# EAGLE design Titan_v1p1_180 (EAGLE 9.6.2)
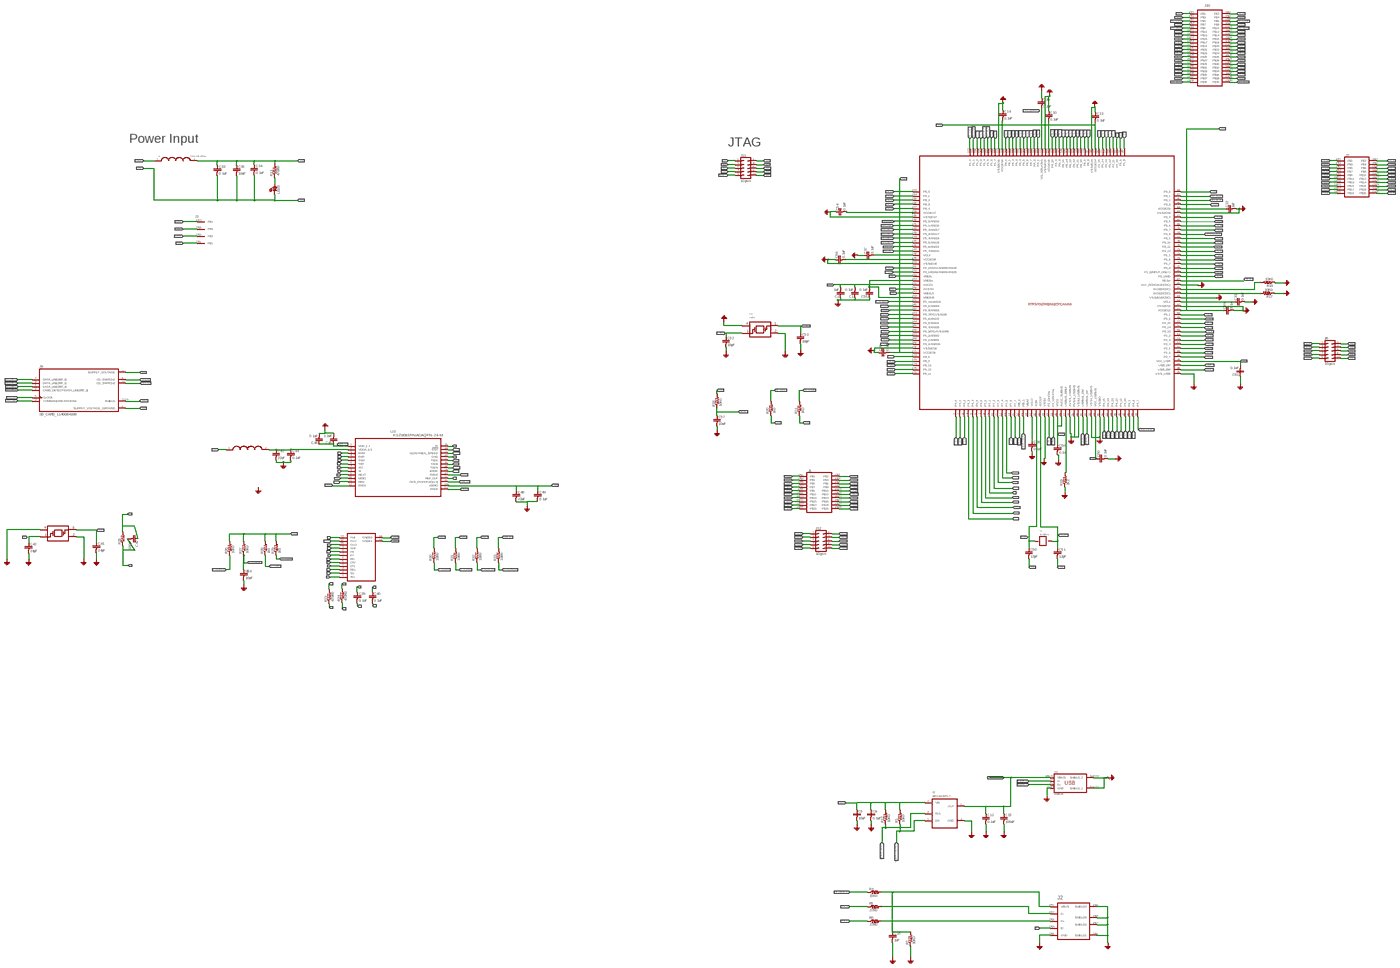
[diagram p0: schematic, sheet 1, overview]
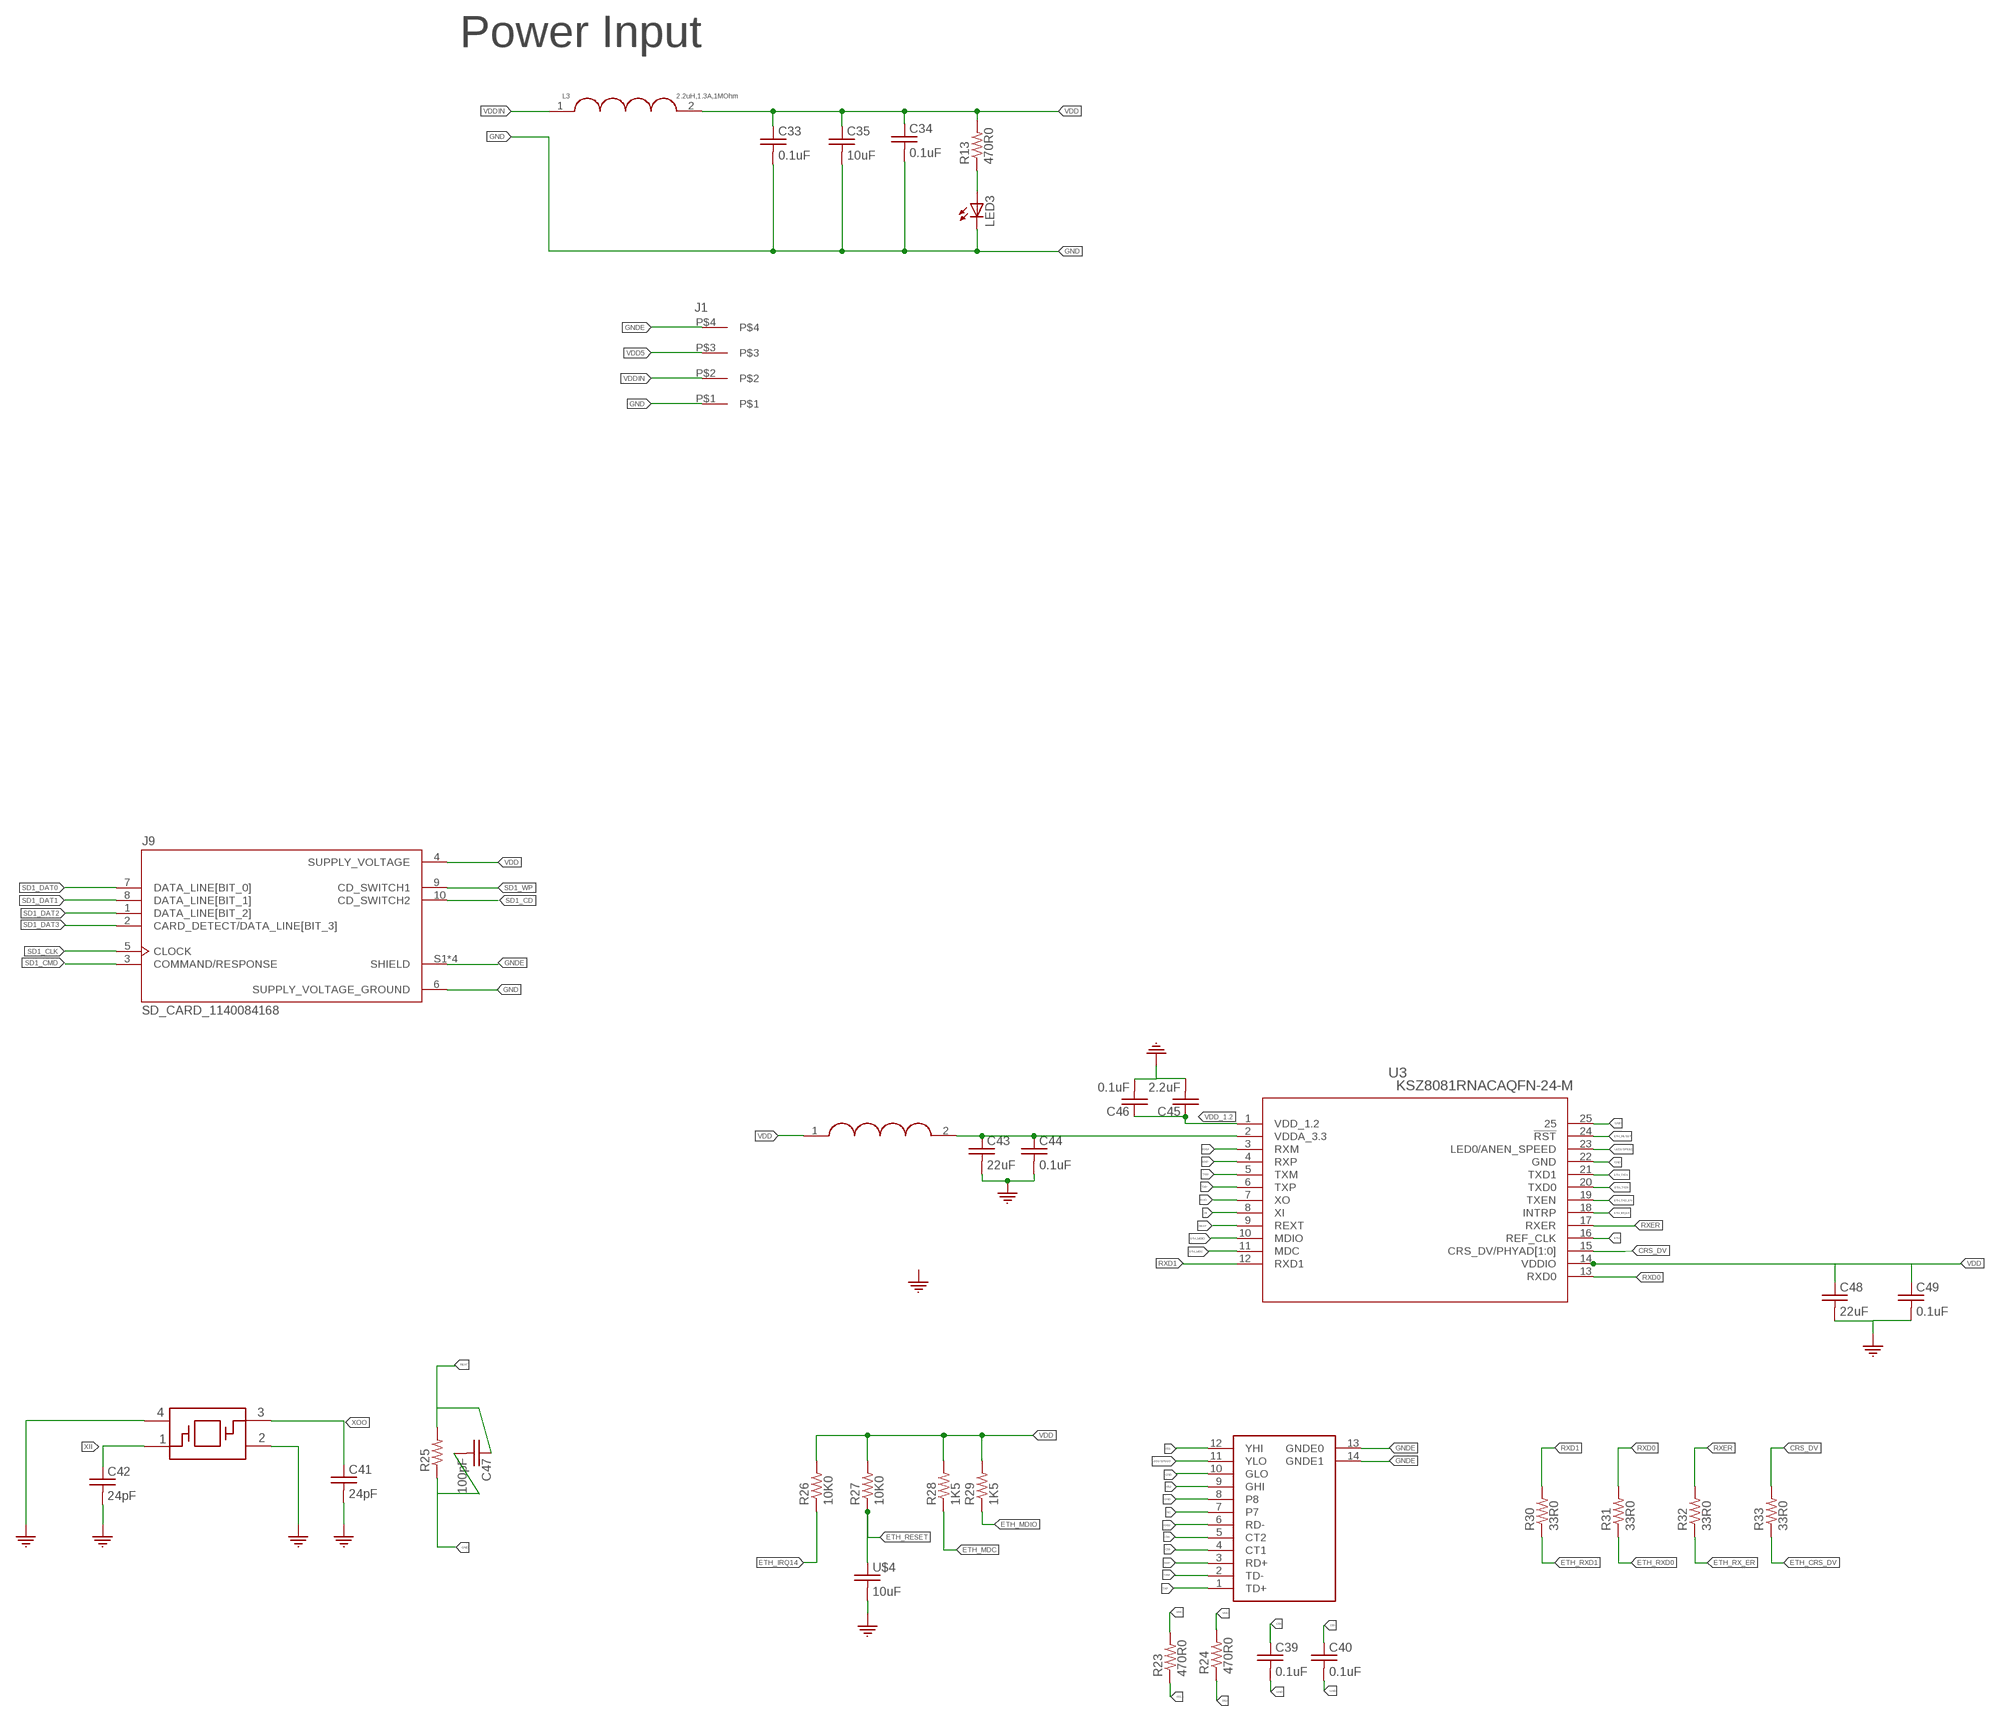
[diagram p1: schematic, sheet 1, part 1 of 4]
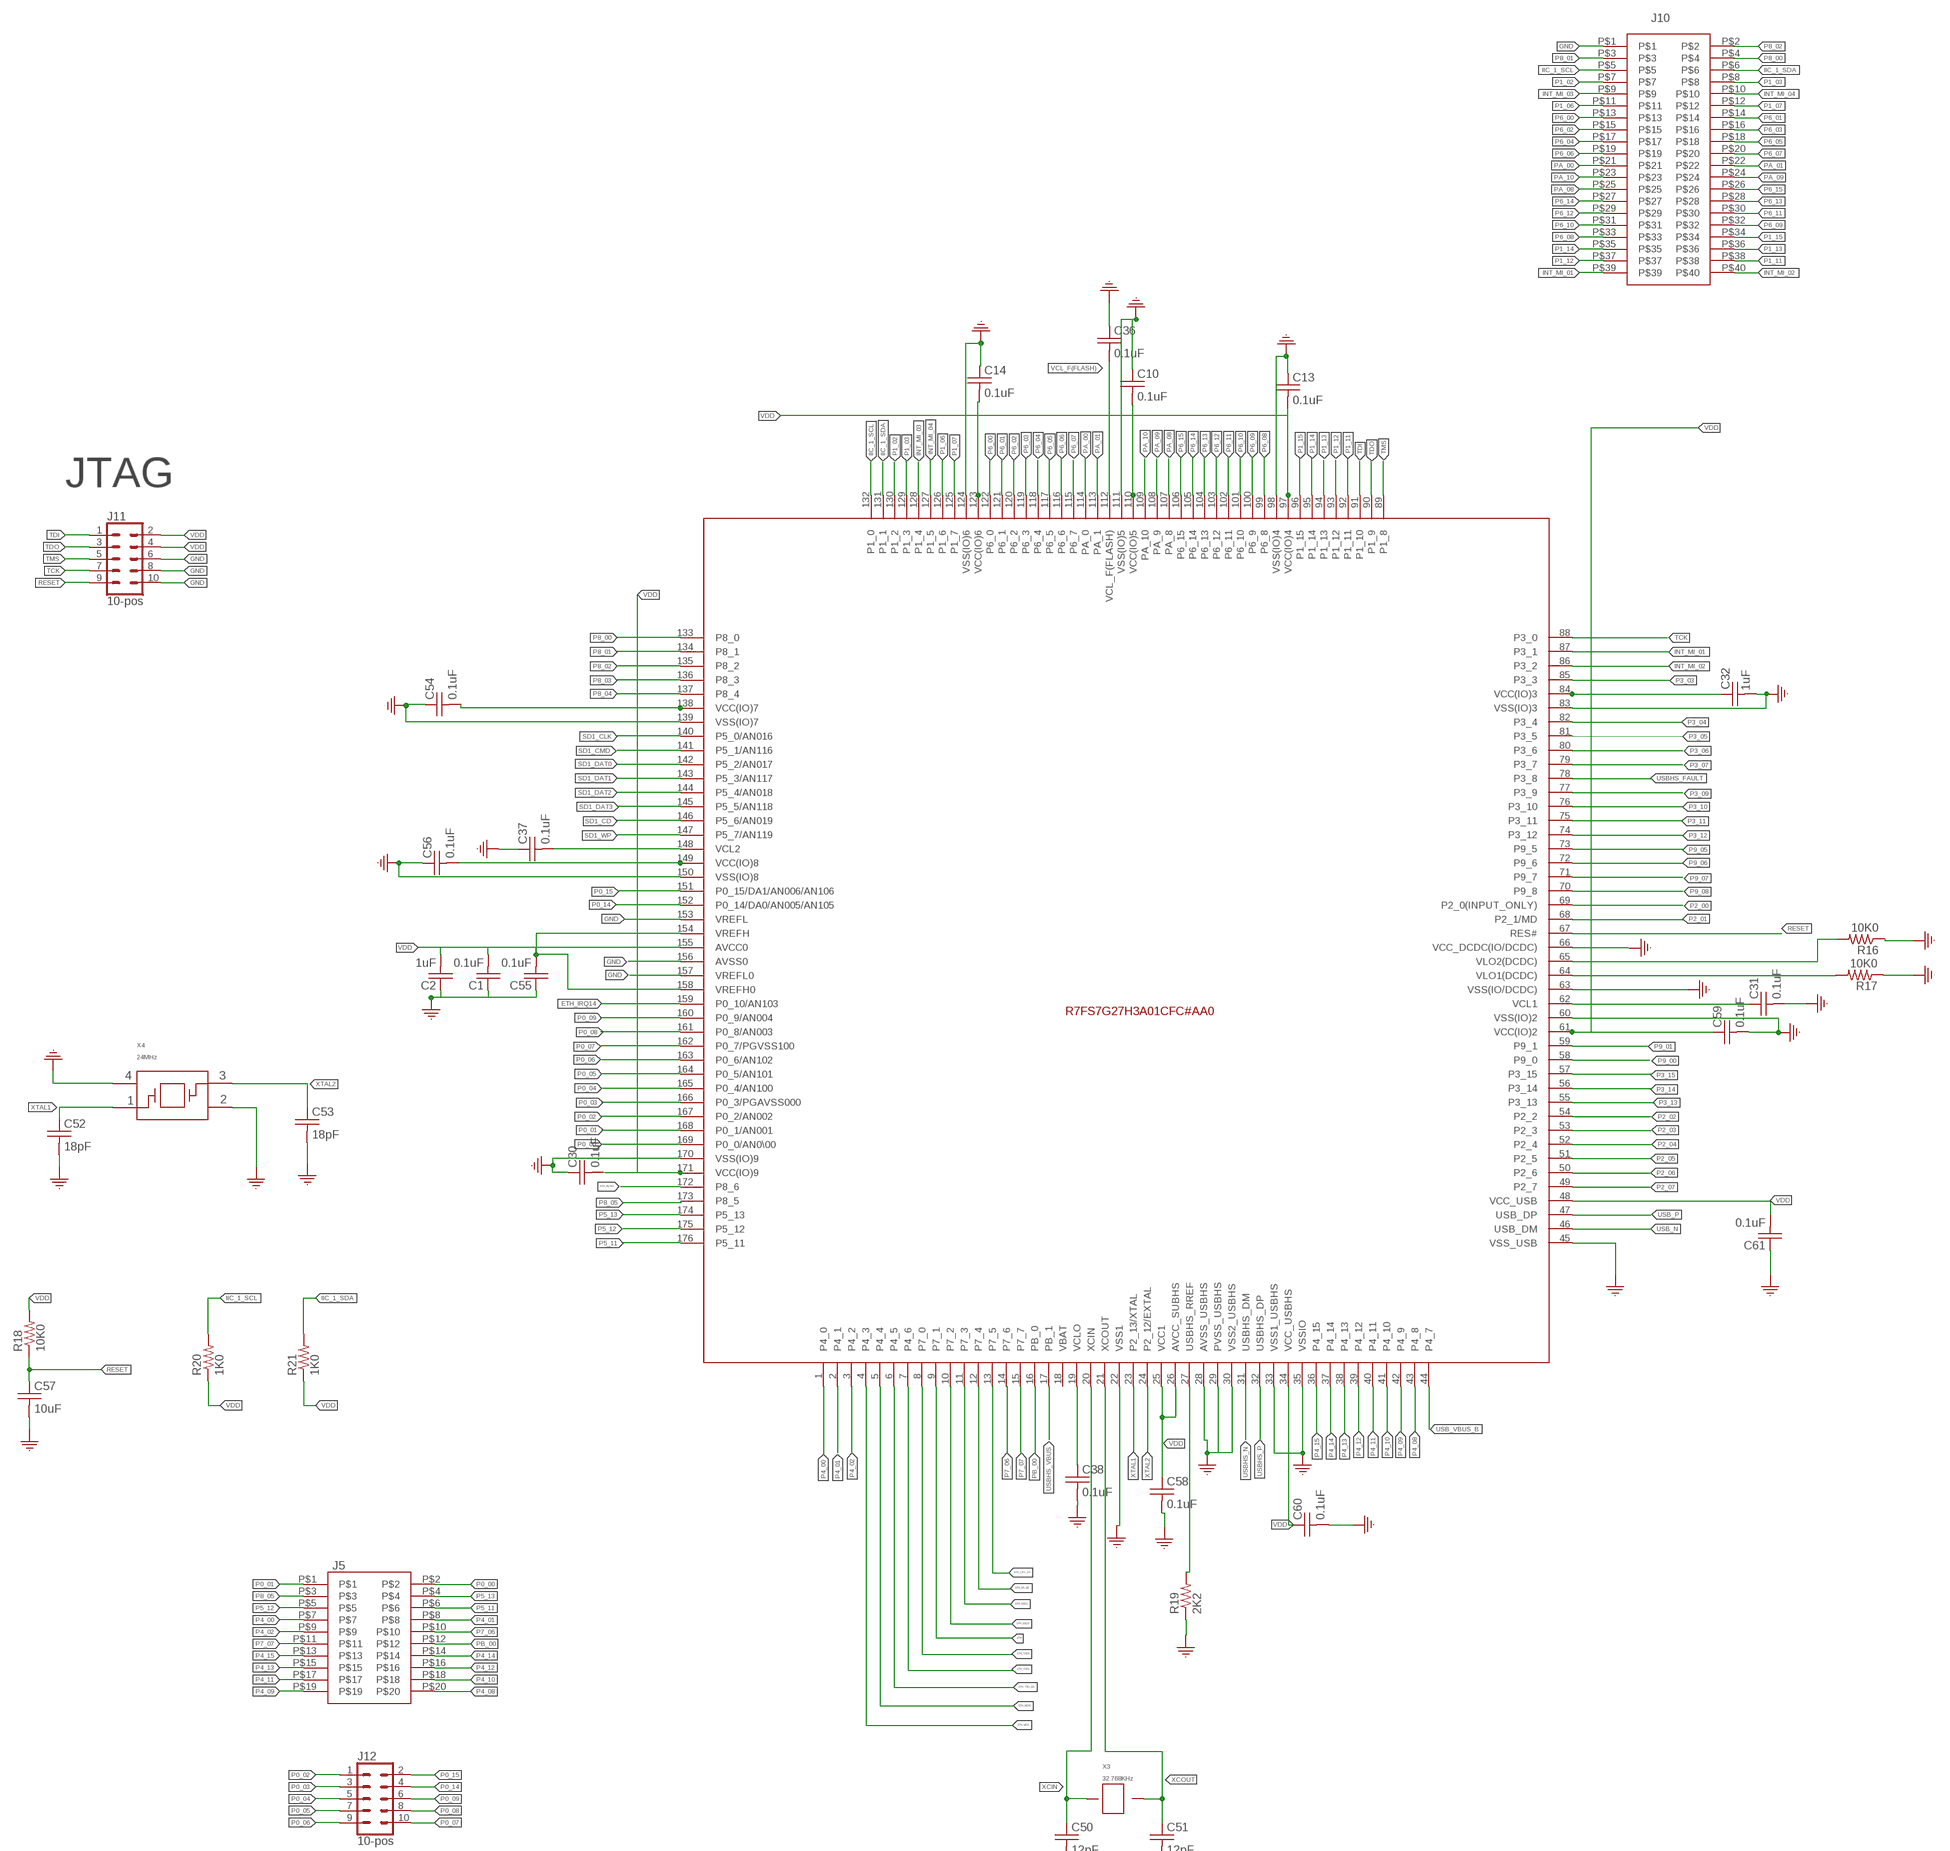
[diagram p2: schematic, sheet 1, part 2 of 4]
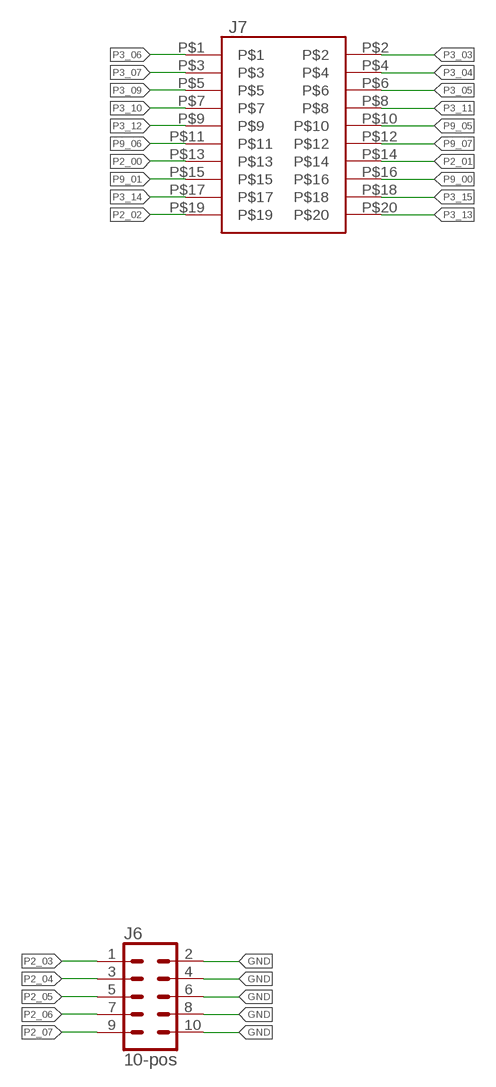
[diagram p3: schematic, sheet 1, part 3 of 4]
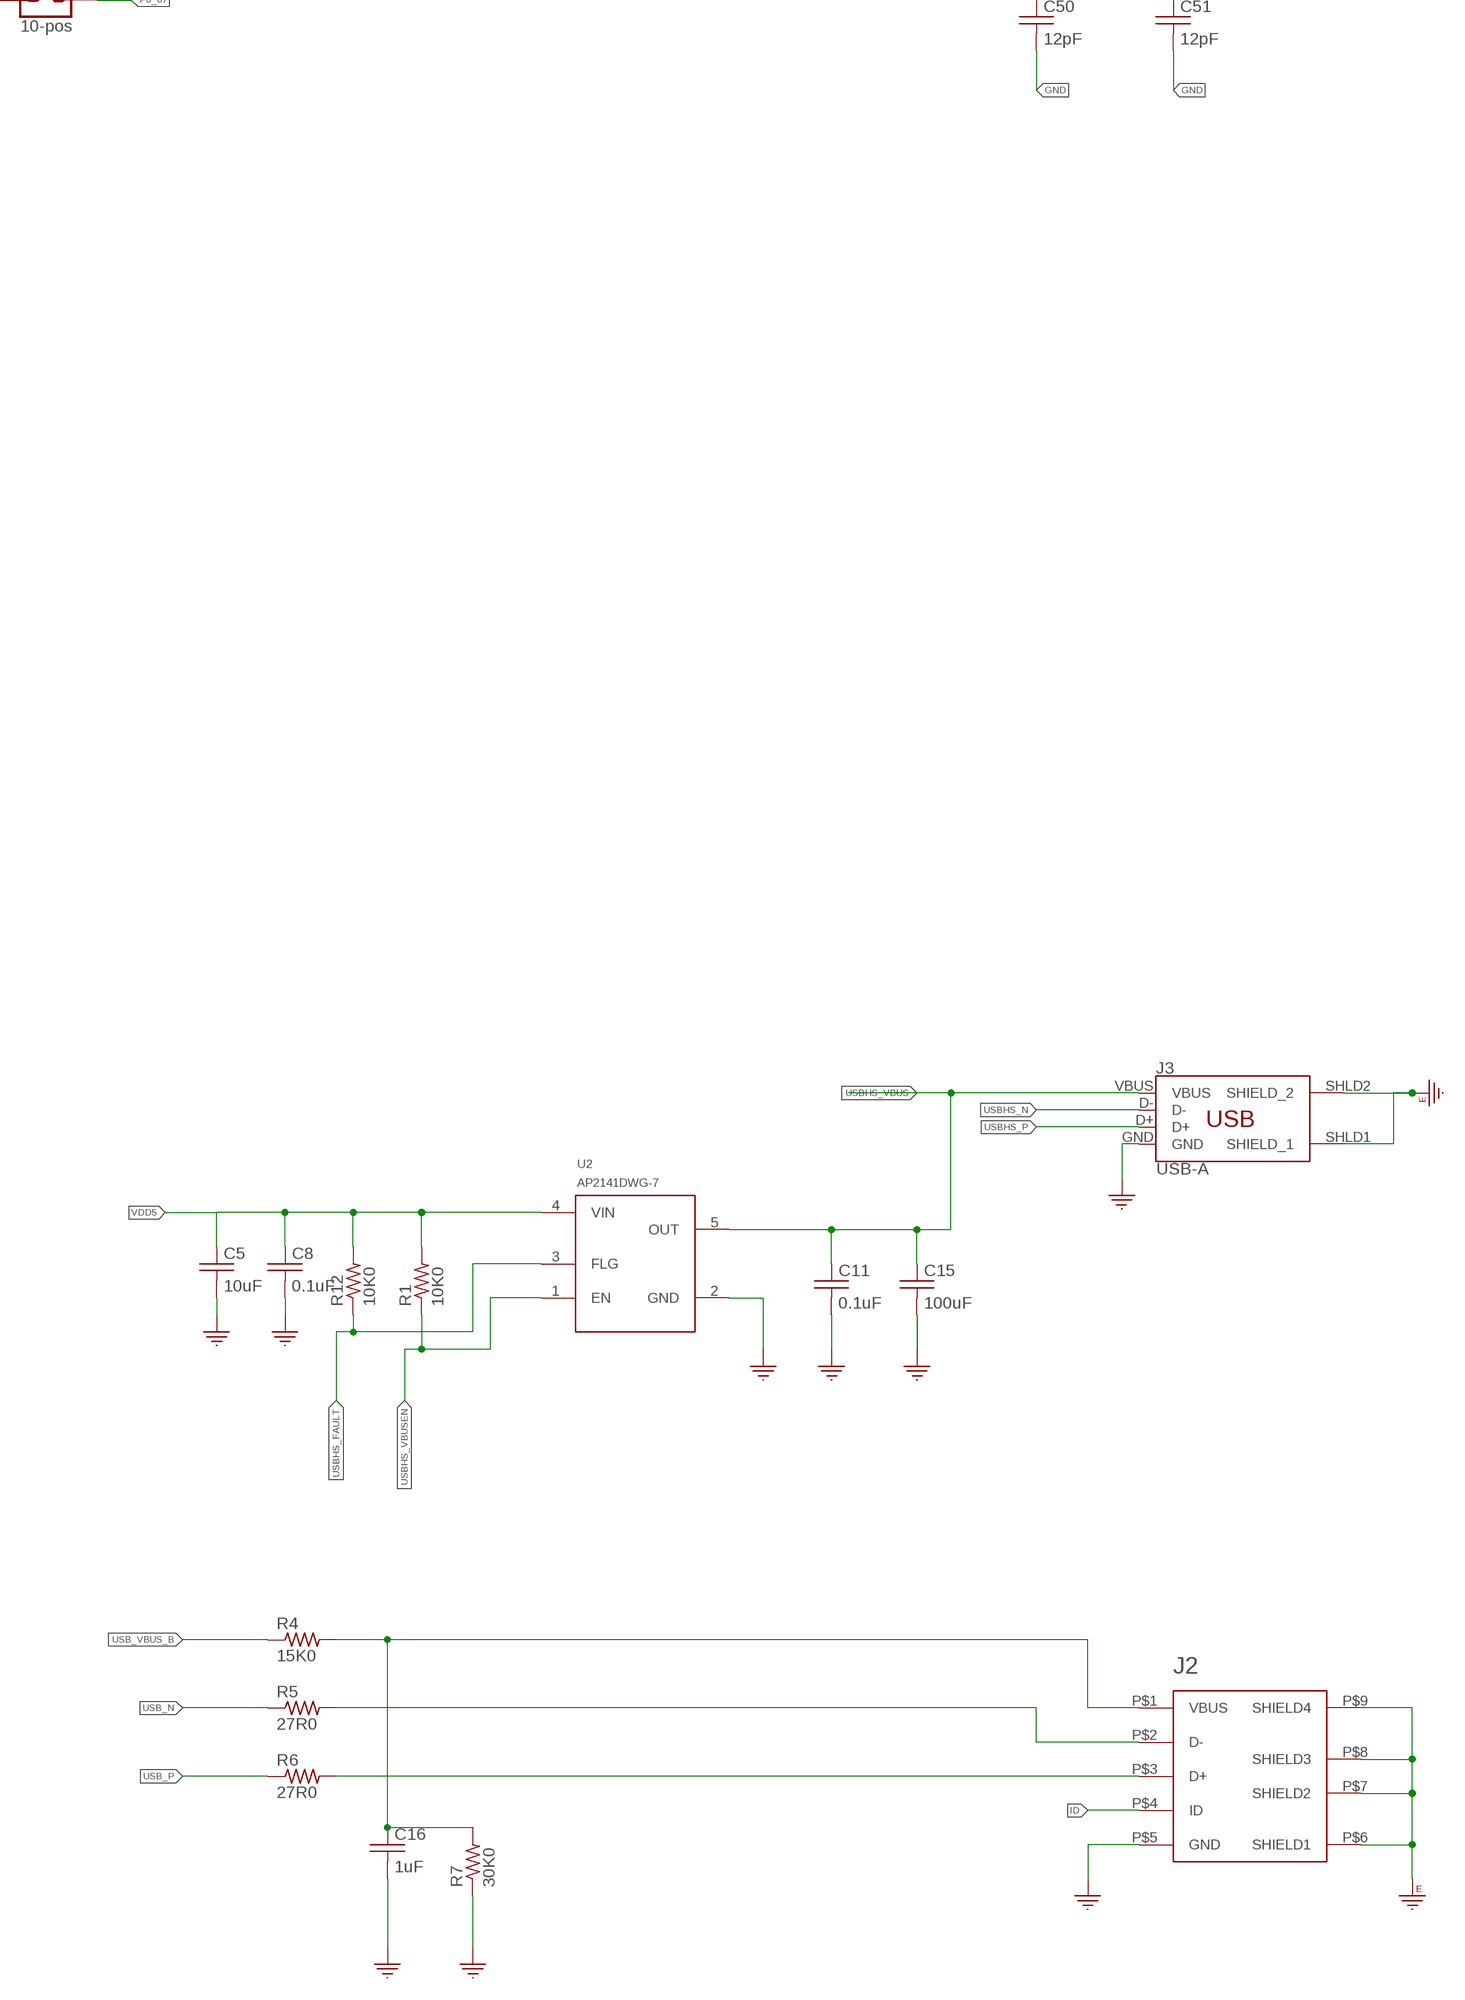
[diagram p4: schematic, sheet 1, part 4 of 4]

## Parts
C1  0.1uF  C_0402_0.1UF  [0402]
C2  1uF  C_0402_1UF  [0402]
C5  10uF  C_0402_10UF  [0402]
C8  0.1uF  C_0402_0.1UF  [0402]
C10  0.1uF  C_0402_0.1UF  [0402]
C11  0.1uF  C_0402_0.1UF  [0402]
C13  0.1uF  C_0402_0.1UF  [0402]
C14  0.1uF  C_0402_0.1UF  [0402]
C15  100uF  C_1210  [C1210]
C16  1uF  C_0402_1UF  [0402]
C30  0.1uF  C_0402_0.1UF  [0402]
C31  0.1uF  C_0402_0.1UF  [0402]
C32  1uF  C_0402_1UF  [0402]
C33  0.1uF  C_0402_0.1UF  [0402]
C34  0.1uF  C_0402_0.1UF  [0402]
C35  10uF  C_0402_10UF  [0402]
C36  0.1uF  C_0402_0.1UF  [0402]
C37  0.1uF  C_0402_0.1UF  [0402]
C38  0.1uF  C_0402_0.1UF  [0402]
C39  0.1uF  C_0402_0.1UF  [0402]
C40  0.1uF  C_0402_0.1UF  [0402]
C41  24pF  C_0402_24PF  [0402]
C42  24pF  C_0402_24PF  [0402]
C43  22uF  C_0402_22UF  [0402]
C44  0.1uF  C_0402_0.1UF  [0402]
C45  2.2uF  C_0402_2.2UF  [0402]
C46  0.1uF  C_0402_0.1UF  [0402]
C47  100pF  C_0402_100PF  [0402]
C48  22uF  C_0402_22UF  [0402]
C49  0.1uF  C_0402_0.1UF  [0402]
C50  12pF  C_0402_12PF  [0402]
C51  12pF  C_0402_12PF  [0402]
C52  18pF  C_0402_18PF  [0402]
C53  18pF  C_0402_18PF  [0402]
C54  0.1uF  C_0402_0.1UF  [0402]
C55  0.1uF  C_0402_0.1UF  [0402]
C56  0.1uF  C_0402_0.1UF  [0402]
C57  10uF  C_0402_10UF  [0402]
C58  0.1uF  C_0402_0.1UF  [0402]
C59  0.1uF  C_0402_0.1UF  [0402]
C60  0.1uF  C_0402_0.1UF  [0402]
C61  0.1uF  C_0402_0.1UF  [0402]
FB2/2  120Ohm  FB_0603_120_OHM0603  [0603]
J1  4-pos  3.81MM_1_X_4_RT_ANGLE_PLUG_HEADER  [1X4_3.81MM_PITCH]
J2  USB-B-Micro  USB_MICRO-B  [USB_MICRO-B]
J3  USB-A  USB_A  [USB_A_SMT]
J4  RJ45  RJ45_WITH_ELEC  [RJ45_TH_ELEC]
J5  20-pos  2_X_10_HEADER_GENERIC  [2_X_10_.1_INCH]
J6  10-pos  CONN_05X2_RAPTH  [2X5]
J7  20-pos  2_X_10_HEADER_GENERIC  [2_X_10_.1_INCH]
J9  SD_CARD_1140084168  [SD_CARD]
J10  40-pos  HEADER_2_X_20_GENERIC  [HEADER_2_X_20_.1_INCH]
J11  10-pos  CONN_05X2_RAPTH  [2X5]
J12  10-pos  CONN_05X2_RAPTH  [2X5]
L3  2.2uH,1.3A,1MOhm  INDUCTOR_1008_2.2_MH_1.3A  [1008]
LED3  Green  LED_0805_GREEN  [0805]
R1  10K0  R_0402_10K0  [0402]
R4  15K0  R_0402_15K0  [0402]
R5  27R0  R_0402_27R0  [0402]
R6  27R0  R_0402_27R0  [0402]
R7  30K0  R_0402_30K0  [0402]
R12  10K0  R_0402_10K0  [0402]
R13  470R0  R_0402_470R0  [0402]
R16  10K0  R_0402_10K0  [0402]
R17  10K0  R_0402_10K0  [0402]
R18  10K0  R_0402_10K0  [0402]
R19  2K2  R_0402_2K2  [0402]
R20  1K0  R_0402_1K0  [0402]
R21  1K0  R_0402_1K0  [0402]
R23  470R0  R_0402_470R0  [0402]
R24  470R0  R_0402_470R0  [0402]
R25  6K49  R_0402_6K49  [0402]
R26  10K0  R_0402_10K0  [0402]
R27  10K0  R_0402_10K0  [0402]
R28  1K5  R_0402_1K5  [0402]
R29  1K5  R_0402_1K5  [0402]
R30  33R0  R_0402_33R0  [0402]
R31  33R0  R_0402_33R0  [0402]
R32  33R0  R_0402_33R0  [0402]
R33  33R0  R_0402_33R0  [0402]
U2  AP2151DWG-7  [SOT-23-5]
U3  KSZ8081RNACAQFN-24-M  [QFN-24-M]
U4  S7G2LQFP176  S7G2_X_176  [LQFP176_24X24]
U5  25MHz  XTAL_25_MHZ  [SMD_3225]
U$4  10uF  C_0402_10UF  [0402]
X3  32.768KHz  XTAL_32.768KHZ  [SMD_X_2_PADS]
X4  24MHz  XTAL_24_MHZ  [SMD_3225]

## Nets
C58: C39.P$1 J4.4(CT1)
C60: C40.P$1 J4.5(CT2)
CRS_DV: R33.P$2 U3.15(CRS_DV/PHYAD[1:0])
D+: J2.P$3(D+) R6.P$2
D-: J2.P$2(D-) R5.P$2
ETH: U3.16(REF_CLK) U4.9(P7_1)
ETH_CRS_DV: R33.P$1 U4.13(P7_5)
ETH_IRQ14: R26.P$1 U3.18(INTRP) U4.159(P0_10/AN103)
ETH_MDC: R28.P$1 U3.11(MDC) U4.4(P4_3)
ETH_MDIO: R29.P$1 U3.10(MDIO) U4.5(P4_4)
ETH_RESET: R27.P$1 U3.24(!RST) U4.172(P8_6) U$4.P$1
ETH_RX_ER: R32.P$1 U4.12(P7_4)
ETH_RXD0: R31.P$1 U4.10(P7_2)
ETH_RXD1: R30.P$1 U4.11(P7_3)
ETH_TXD0: U3.20(TXD0) U4.8(P7_0)
ETH_TXD1: U3.21(TXD1) U4.7(P4_6)
ETH_TXD_EN: U3.19(TXEN) U4.6(P4_5)
GND: C1.P$1 C2.P$1 C5.P$2 C8.P$2 C10.P$1 C11.P$2 C13.P$1 C14.P$1 C15.2 C16.P$2 C30.P$1 C31.P$2 C32.P$2 C33.P$2 C34.P$2 C35.P$2 C36.P$1 C37.P$1 C38.P$2 C39.P$2 C40.P$2 C41.P$2 C42.P$2 C43.P$2 C44.P$2 C45.P$2 C46.P$2 C47.P$2 C48.P$2 C49.P$2 C50.P$2 C51.P$2 C52.P$2 C53.P$2 C54.P$1 C55.P$1 C56.P$1 C57.P$2 C58.P$2 C59.P$2 C60.P$2 C61.P$1 J1.P$1 J2.P$5(GND) J3.GND J4.8 J4.10(GLO) J6.2 J6.4 J6.6 J6.8 J6.10 J9.6(SUPPLY_VOLTAGE_GROUND) J10.P$1 J11.6 J11.8 J11.10 LED3.2(C) R7.P$1 R16.P$1 R17.P$1 R19.P$1 R25.P$1 U2.2(GND) U3.22(GND) U3.25 U4.22(VSS1) U4.28(AVSS_USBHS) U4.29(PVSS_USBHS) U4.30(VSS2_USBHS) U4.33(VSS1_USBHS) U4.35(VSSIO) U4.45(VSS_USB) U4.60(VSS(IO)2) U4.63(VSS(IO/DCDC)) U4.66(VCC_DCDC(IO/DCDC)) U4.83(VSS(IO)3) U4.98(VSS(IO)4) U4.111(VSS(IO)5) U4.124(VSS(IO)6) U4.139(VSS(IO)7) U4.150(VSS(IO)8) U4.153(VREFL) U4.156(AVSS0) U4.157(VREFL0) U4.170(VSS(IO)9) U5.2 U5.4 U$4.P$2 X4.2 X4.4
GNDE: J1.P$4 J2.P$6(SHIELD1) J2.P$7(SHIELD2) J2.P$8(SHIELD3) J2.P$9(SHIELD4) J3.SHLD1(SHIELD_1) J3.SHLD2(SHIELD_2) J4.13(GNDE0) J4.14(GNDE1) J9.S1(SHIELD) J9.S2(SHIELD) J9.S3(SHIELD) J9.S4(SHIELD)
ID: J2.P$4(ID)
IIC_1_SCL: J10.P$5 R20.P$2 U4.132(P1_0)
IIC_1_SDA: J10.P$6 R21.P$2 U4.131(P1_1)
INT_MI_01: J10.P$39 U4.87(P3_1)
INT_MI_02: J10.P$40 U4.86(P3_2)
INT_MI_03: J10.P$9 U4.128(P1_4)
INT_MI_04: J10.P$10 U4.127(P1_5)
LED1/SPEED: J4.11(YLO) U3.23(LED0/ANEN_SPEED)
N$1: C37.P$2 U4.148(VCL2)
N$3: LED3.1(A) R13.P$1
N$4: C38.P$1 U4.19(VCLO)
N$5: C31.P$1 U4.62(VCL1)
N$6: R17.P$2 U4.64(VLO1(DCDC))
N$7: R16.P$2 U4.65(VLO2(DCDC))
N$8: R19.P$2 U4.27(USBHS_RREF)
NC: J4.7
P0_00: J5.P$2 U4.169(P0_0/AN0\00)
P0_01: J5.P$1 U4.168(P0_1/AN001)
P0_02: J12.1 U4.167(P0_2/AN002)
P0_03: J12.3 U4.166(P0_3/PGAVSS000)
P0_04: J12.5 U4.165(P0_4/AN100)
P0_05: J12.7 U4.164(P0_5/AN101)
P0_06: J12.9 U4.163(P0_6/AN102)
P0_07: J12.10 U4.162(P0_7/PGVSS100)
P0_08: J12.8 U4.161(P0_8/AN003)
P0_09: J12.6 U4.160(P0_9/AN004)
P0_14: J12.4 U4.152(P0_14/DA0/AN005/AN105)
P0_15: J12.2 U4.151(P0_15/DA1/AN006/AN106)
P1_02: J10.P$7 U4.130(P1_2)
P1_03: J10.P$8 U4.129(P1_3)
P1_06: J10.P$11 U4.126(P1_6)
P1_07: J10.P$12 U4.125(P1_7)
P1_11: J10.P$38 U4.92(P1_11)
P1_12: J10.P$37 U4.93(P1_12)
P1_13: J10.P$36 U4.94(P1_13)
P1_14: J10.P$35 U4.95(P1_14)
P1_15: J10.P$34 U4.96(P1_15)
P2_00: J7.P$13 U4.69(P2_0(INPUT_ONLY))
P2_01: J7.P$14 U4.68(P2_1/MD)
P2_02: J7.P$19 U4.54(P2_2)
P2_03: J6.1 U4.53(P2_3)
P2_04: J6.3 U4.52(P2_4)
P2_05: J6.5 U4.51(P2_5)
P2_06: J6.7 U4.50(P2_6)
P2_07: J6.9 U4.49(P2_7)
P3_03: J7.P$2 U4.85(P3_3)
P3_04: J7.P$4 U4.82(P3_4)
P3_05: J7.P$6 U4.81(P3_5)
P3_06: J7.P$1 U4.80(P3_6)
P3_07: J7.P$3 U4.79(P3_7)
P3_09: J7.P$5 U4.77(P3_9)
P3_10: J7.P$7 U4.76(P3_10)
P3_11: J7.P$8 U4.75(P3_11)
P3_12: J7.P$9 U4.74(P3_12)
P3_13: J7.P$20 U4.55(P3_13)
P3_14: J7.P$17 U4.56(P3_14)
P3_15: J7.P$18 U4.57(P3_15)
P4_00: J5.P$7 U4.1(P4_0)
P4_01: J5.P$8 U4.2(P4_1)
P4_02: J5.P$9 U4.3(P4_2)
P4_08: J5.P$20 U4.43(P4_8)
P4_09: J5.P$19 U4.42(P4_9)
P4_10: J5.P$18 U4.41(P4_10)
P4_11: J5.P$17 U4.40(P4_11)
P4_12: J5.P$16 U4.39(P4_12)
P4_13: J5.P$15 U4.38(P4_13)
P4_14: J5.P$14 U4.37(P4_14)
P4_15: J5.P$13 U4.36(P4_15)
P5_11: J5.P$6 U4.176(P5_11)
P5_12: J5.P$5 U4.175(P5_12)
P5_13: J5.P$4 U4.174(P5_13)
P6_00: J10.P$13 U4.122(P6_0)
P6_01: J10.P$14 U4.121(P6_1)
P6_02: J10.P$15 U4.120(P6_2)
P6_03: J10.P$16 U4.119(P6_3)
P6_04: J10.P$17 U4.118(P6_4)
P6_05: J10.P$18 U4.117(P6_5)
P6_06: J10.P$19 U4.116(P6_6)
P6_07: J10.P$20 U4.115(P6_7)
P6_08: J10.P$33 U4.99(P6_8)
P6_09: J10.P$32 U4.100(P6_9)
P6_10: J10.P$31 U4.101(P6_10)
P6_11: J10.P$30 U4.102(P6_11)
P6_12: J10.P$29 U4.103(P6_12)
P6_13: J10.P$28 U4.104(P6_13)
P6_14: J10.P$27 U4.105(P6_14)
P6_15: J10.P$26 U4.106(P6_15)
P7_06: J5.P$10 U4.14(P7_6)
P7_07: J5.P$11 U4.15(P7_7)
P8_00: J10.P$4 U4.133(P8_0)
P8_01: J10.P$3 U4.134(P8_1)
P8_02: J10.P$2 U4.135(P8_2)
P8_03: U4.136(P8_3)
P8_04: U4.137(P8_4)
P8_05: J5.P$3 U4.173(P8_5)
P9_00: J7.P$16 U4.58(P9_0)
P9_01: J7.P$15 U4.59(P9_1)
P9_05: J7.P$10 U4.73(P9_5)
P9_06: J7.P$11 U4.72(P9_6)
P9_07: J7.P$12 U4.71(P9_7)
P9_08: U4.70(P9_8)
PA_00: J10.P$21 U4.114(PA_0)
PA_01: J10.P$22 U4.113(PA_1)
PA_08: J10.P$25 U4.107(PA_8)
PA_09: J10.P$24 U4.108(PA_9)
PA_10: J10.P$23 U4.109(PA_10)
PB_00: J5.P$12 U4.16(PB_0)
R51: J4.12(YHI) R23.P$1
R52: J4.9(GHI) R24.P$1
RESET: C57.P$1 J11.9 R18.P$1 U4.67(RES#)
REXT: C47.P$1 R25.P$2 U3.9(REXT)
RXD0: R31.P$2 U3.13(RXD0)
RXD1: R30.P$2 U3.12(RXD1)
RXER: R32.P$2 U3.17(RXER)
RXM: J4.6(RD-) U3.3(RXM)
RXP: J4.3(RD+) U3.4(RXP)
SD1_CD: J9.10(CD_SWITCH2) U4.146(P5_6/AN019)
SD1_CLK: J9.5(CLOCK) U4.140(P5_0/AN016)
SD1_CMD: J9.3(COMMAND/RESPONSE) U4.141(P5_1/AN116)
SD1_DAT0: J9.7(DATA_LINE[BIT_0]) U4.142(P5_2/AN017)
SD1_DAT1: J9.8(DATA_LINE[BIT_1]) U4.143(P5_3/AN117)
SD1_DAT2: J9.1(DATA_LINE[BIT_2]) U4.144(P5_4/AN018)
SD1_DAT3: J9.2(CARD_DETECT/DATA_LINE[BIT_3]) U4.145(P5_5/AN118)
SD1_WP: J9.9(CD_SWITCH1) U4.147(P5_7/AN119)
TCK: J11.7 U4.88(P3_0)
TDI: J11.1 U4.91(P1_10)
TDO: J11.3 U4.90(P1_9)
TMS: J11.5 U4.89(P1_8)
TXM: J4.2(TD-) U3.5(TXM)
TXP: J4.1(TD+) U3.6(TXP)
USB_N: R5.P$1 U4.46(USB_DM)
USB_P: R6.P$1 U4.47(USB_DP)
USB_VBUS_B: R4.P$1 U4.44(P4_7)
USBHS_FAULT: R12.P$1 U2.3(FLG) U4.78(P3_8)
USBHS_N: J3.D- U4.31(USBHS_DM)
USBHS_P: J3.D+ U4.32(USBHS_DP)
USBHS_VBUS: C11.P$1 C15.1 J3.VBUS U2.5(OUT) U4.17(PB_1)
USBHS_VBUSEN: R1.P$1 U2.1(EN)
VBUS: C16.P$1 J2.P$1(VBUS) R4.P$2 R7.P$2
VCL_F(FLASH): C36.P$2 U4.112(VCL_F(FLASH))
VDD: C1.P$2 C2.P$2 C10.P$2 C13.P$2 C14.P$2 C30.P$2 C32.P$1 C33.P$1 C34.P$1 C35.P$1 C48.P$1 C49.P$1 C54.P$2 C55.P$2 C56.P$2 C58.P$1 C59.P$1 C60.P$1 C61.P$2 FB2/2.1 J9.4(SUPPLY_VOLTAGE) J11.2 J11.4 L3.2 R13.P$2 R18.P$2 R20.P$1 R21.P$1 R23.P$2 R24.P$2 R26.P$2 R27.P$2 R28.P$2 R29.P$2 U3.14(VDDIO) U4.25(VCC1) U4.26(AVCC_SUBHS) U4.34(VCC_USBHS) U4.48(VCC_USB) U4.61(VCC(IO)2) U4.84(VCC(IO)3) U4.97(VCC(IO)4) U4.110(VCC(IO)5) U4.123(VCC(IO)6) U4.138(VCC(IO)7) U4.149(VCC(IO)8) U4.154(VREFH) U4.155(AVCC0) U4.158(VREFH0) U4.171(VCC(IO)9)
VDD5: C5.P$1 C8.P$1 J1.P$3 R1.P$2 R12.P$2 U2.4(VIN)
VDD_1.2: C45.P$1 C46.P$1 U3.1(VDD_1.2)
VDD_ENET1: C43.P$1 C44.P$1 FB2/2.2 U3.2(VDDA_3.3)
VDDIN: J1.P$2 L3.1
XCIN: C50.P$1 U4.20(XCIN) X3.P$1
XCOUT: C51.P$1 U4.21(XCOUT) X3.P$2
XII: C42.P$1 U3.8(XI) U5.1
XOO: C41.P$1 U3.7(XO) U5.3
XTAL1: C52.P$1 U4.23(P2_13/XTAL) X4.1
XTAL2: C53.P$1 U4.24(P2_12/EXTAL) X4.3
Unconnected: U4.18(VBAT)

## Notes on the sheet
- Power Input | JTAG

## Library data of the parts
C1 C8 C10 C11 C13 C14 C30 C31 C33 C34 C36-C40 C44 C46 C49 C54-C56 C58-C61 = 3D_MIG_Controller:C_0402_0.1UF; PARTNO: CL05F104ZO5NNNC
C2 C16 C32 = 3D_MIG_Controller:C_0402_1UF; PARTNO: CL05A105KO5NNNC
C5 C35 C57 U$4 = 3D_MIG_Controller:C_0402_10UF; PARTNO: CL05A106MP8NUB8
C15 = 3D_MIG_Controller:C_1210; PARTNO: TL8A0107M010D
C41 C42 = 3D_MIG_Controller:C_0402_24PF; PARTNO: CC0402GRNPO9BN240
C43 C48 = 3D_MIG_Controller:C_0402_22UF; PARTNO: CL05A226MQ5N6J8
C45 = 3D_MIG_Controller:C_0402_2.2UF; PARTNO: GRM155C81C225ME15D
C47 = 3D_MIG_Controller:C_0402_100PF; PARTNO: CL05C101JB5NNNC
C50 C51 = 3D_MIG_Controller:C_0402_12PF; PARTNO: CL05C120JB5NNNC
C52 C53 = 3D_MIG_Controller:C_0402_18PF; PARTNO: UMK105CG180JV-F
FB2/2 = 3D_MIG_Controller:FB_0603_120_OHM; PARTNO: BLM18PG121SN1D
J1 = 3D_MIG_Controller:3.81MM_1_X_4_RT_ANGLE_PLUG_HEADER: 4 Position Terminal Block Header, Male Pins, Shrouded (4 Side) 0.150" (3.81mm) 90°, Right Angle - Through Hole; PARTNO: 691322310004
J2 = 3D_MIG_Controller:USB_MICRO-B; PARTNO: 10118192-0002LF
J3 = 3D_MIG_Controller:USB_A: USB-A Connector Male and female variants, as well as PTH and SMT variants SparkFun Products: SparkFun XBee Explorer Dongle <https://www.sparkfun.com/products/11697> PTH Male SparkFun MicroView-USB Programmer <https://www.sparkfun.com/products/12924> SMT Male SparkFun USB Type A Female Breakout <https://www.sparkfun.com/products/12700> SMT Female; PARTNO: 87583-3010RPALF
J4 = 3D_MIG_Controller:RJ45_WITH_ELEC; MAN: Shanghai YDS Tech; PARTNO: 13F-64GYD2PL2NL; VENDOR: lcsc.com
J5 J7 = 3D_MIG_Controller:2_X_10_HEADER_GENERIC: CONN HEADER R/A 20POS 2.54MM, Straight, Right Angle; PARTNO: 67996-420HLF
J6 J11 J12 = 3D_MIG_Controller:CONN_05X2_RA: Connector Header Through Hole, Right Angle 10 position 0.100" (2.54mm); PARTNO: PH2RA-10-UA
J9 = 3D_MIG_Controller:SD_CARD_1140084168: Conn; IC Socket; Micro SD; Right Angle; PCB Mount; MicroSD Ser.:: 10 _8 + 2_ Position Card Connector Secure Digital - microSD™ Surface Mount, Right Angle Gold; MF: Amphenol ICC; PARTNO: 114-00841-68; VID: Digikey; VP: 114-00841-68-1-ND; VURL: https://www.digikey.ae/product-detail/en/amphenol-icc-commercial-products/114-00841-68/114-00841-68-1-ND/2187101?utm_source=snapeda&utm_medium=aggregator&utm_campaign=symbol
J10 = 3D_MIG_Controller:HEADER_2_X_20_GENERIC: CONN HEADER R/A 40POS 2.54MM; PARTNO: 61304021021
L3 = 3D_MIG_Controller:INDUCTOR_1008_2.2_MH_1.3A; PARTNO: LQM2HPN2R2MG0L
LED3 = 3D_MIG_Controller:LED_0805_GREEN: Green 570nm LED Indication - Discrete 2.2V 0805 (2012 Metric); PARTNO: LG R971-KN-1
R1 R12 R16-R18 R26 R27 = 3D_MIG_Controller:R_0402_10K0; PARTNO: RMCF0402JT10K0
R4 = 3D_MIG_Controller:R_0402_15K0; PARTNO: RMCF0402JT15K0
R5 R6 = 3D_MIG_Controller:R_0402_27R0; PARTNO: RMCF0402JT27R0
R7 = 3D_MIG_Controller:R_0402_30K0; PARTNO: RC0402JR-0730KL
R13 R23 R24 = 3D_MIG_Controller:R_0402_470R0; PARTNO: RMCF0402JT470R
R19 = 3D_MIG_Controller:R_0402_2K2; PARTNO: RMCF0402JT2K20
R20 R21 = 3D_MIG_Controller:R_0402_1K0; PARTNO: CRG0402J1K0
R25 = 3D_MIG_Controller:R_0402_6K49; PARTNO: RMCF0402FT6K49
R28 R29 = 3D_MIG_Controller:R_0402_1K5; PARTNO: RMCF0402JT1K50
R30-R33 = 3D_MIG_Controller:R_0402_33R0; PARTNO: RMCF0402JT33R0
U2 = 3D_MIG_Controller:AP2151DWG-7: Power Switch/Driver 1:1 P-Channel 500mA SOT-25; PARTNO: AP2151WG-7
U3 = 3D_MIG_Controller:KSZ8081RNACA; PARTNO: KSZ8081RNACA; VENDOR: Micrel
U4 = 3D_MIG_Controller:S7G2_X_176; PARTNO: R7FS7G27H3A01CFC#AA0
U5 = 3D_MIG_Controller:XTAL_25_MHZ; PARTNO: FA-238 25.0000MB-B3
X3 = 3D_MIG_Controller:XTAL_32.768KHZ; PARTNO: ABS07-32.768KHZ-T
X4 = 3D_MIG_Controller:XTAL_24_MHZ; PARTNO: FA-238 24.0000MB-C3

## Board
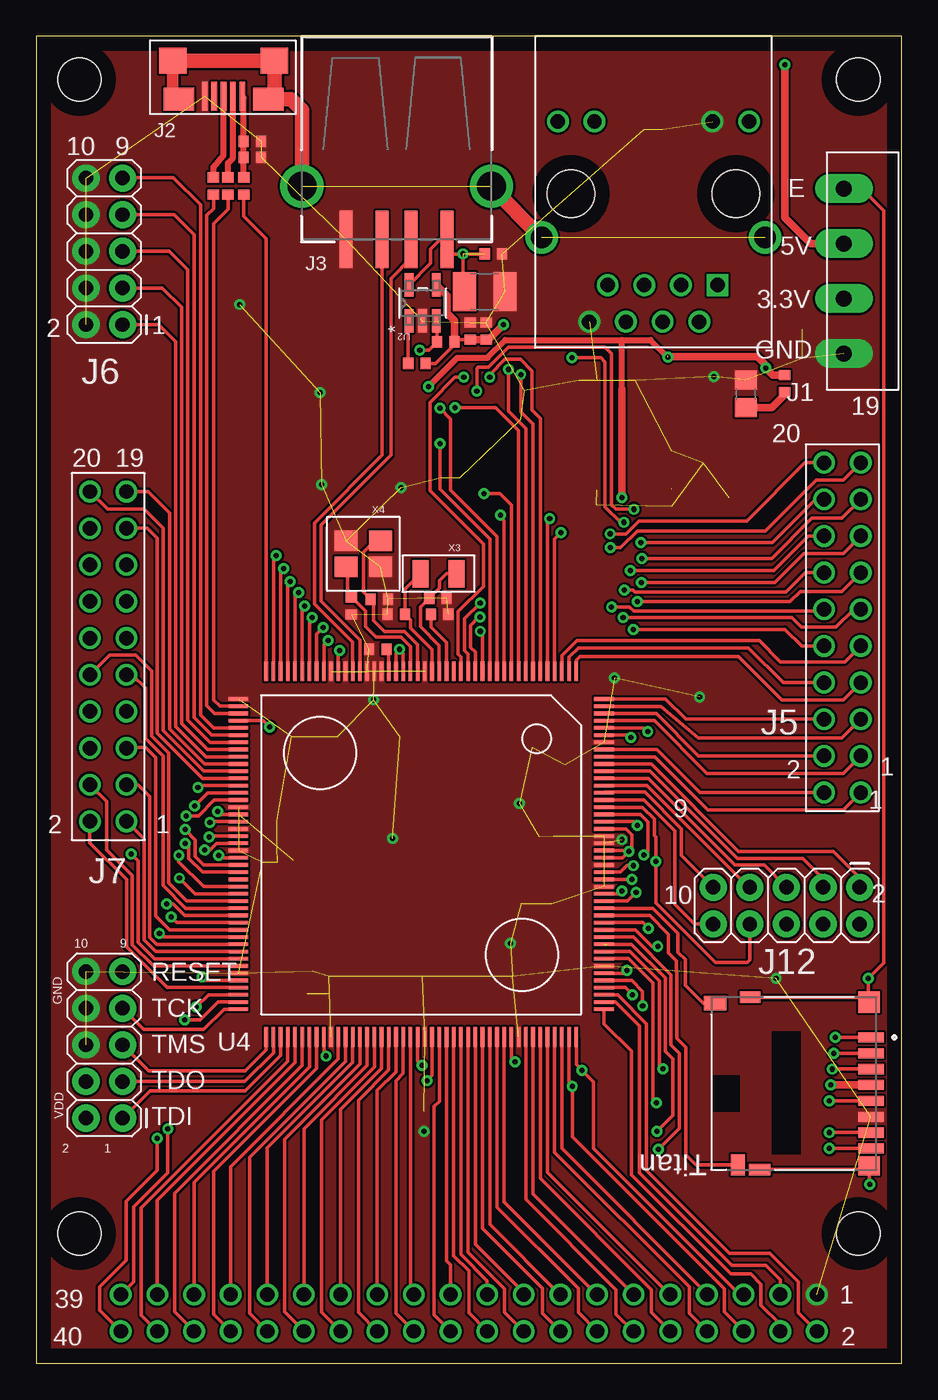
[diagram p5: board, top side]
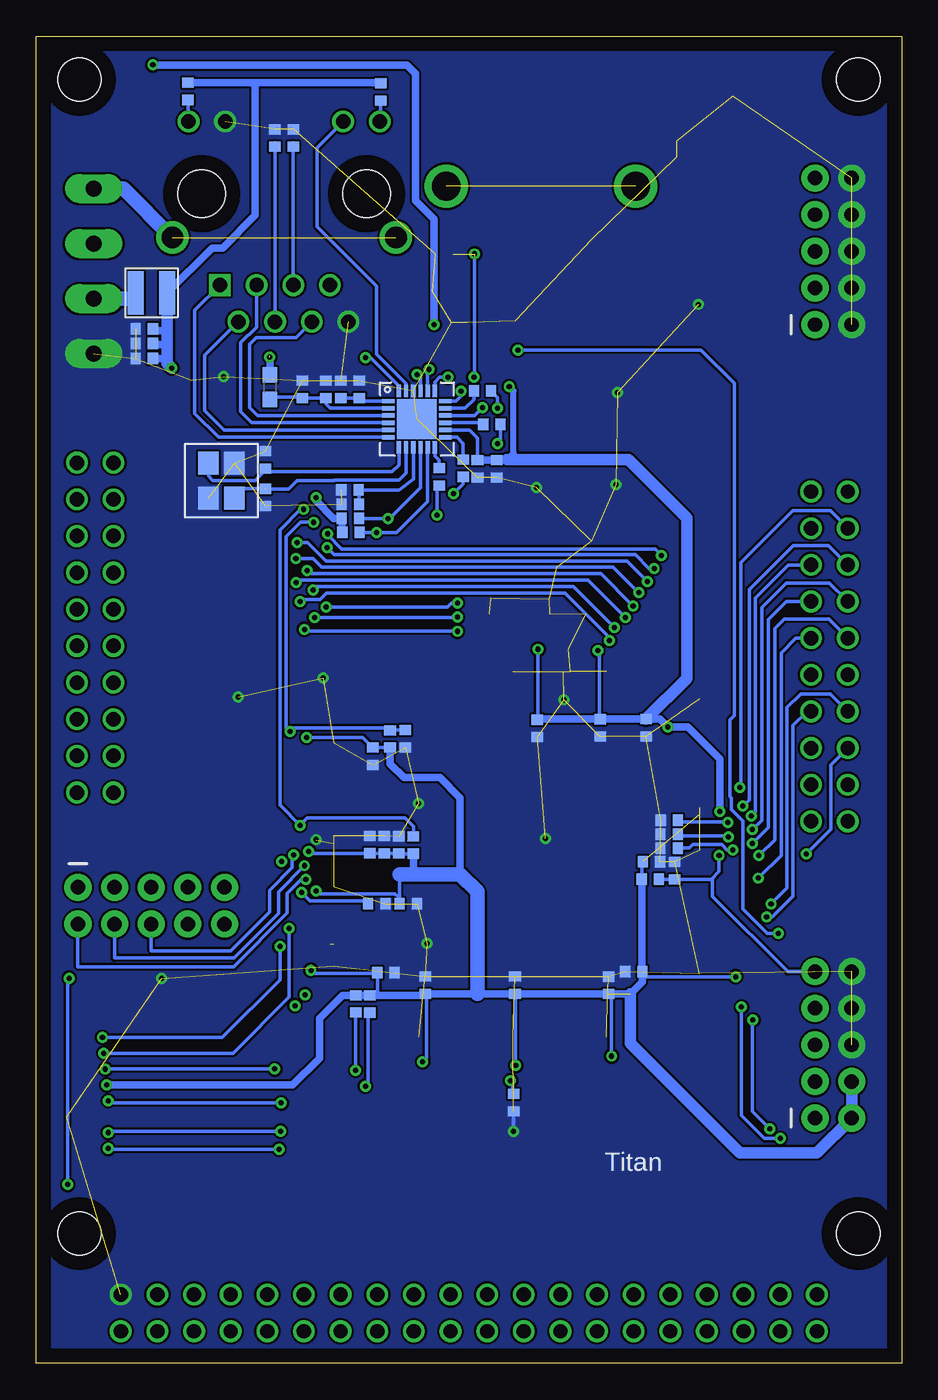
[diagram p6: board, bottom side, seen from below]

Size 60 x 92 mm. Coordinates in mm from the lower left corner, seen from the top.
Outline: 60,92 0,92 0,0 60,0 60,92
Copper layers (1*16): Top 0.035mm / dielectric 1.5mm / Bottom 0.035mm
Design rules "default": minimum track width 6mil, minimum drill 0.35mm, track to track 6mil, track to pad 6mil, pad to pad 6mil, via to via 6mil, smd to smd 6mil, copper to edge 40mil, drill to drill 6mil, minimum pad ring 10mil, minimum via ring 8mil, stop-mask expansion 4mil, vias tented up to drill 0mil, thermal gap 10mil
Holes 3 mm at 57,9 3,9 3,89 57,89

### Footprints (pad centres in the part's own frame; a part is rotated, then mirrored left to right if it is on the bottom)
0402 = smd 0.8 x 0.7: P$1 0,0.6; P$2 0,-0.6
C1210 = smd 1.6 x 2.7: 1 -1.4,0; 2 1.4,0
0603 = smd 1.1 x 1: 1 -0.85,0; 2 0.85,0
1X4_3.81MM_PITCH = drill 1.1 pad 2 long: P$1 0,0; P$2 3.81,0; P$3 7.62,0; P$4 11.43,0
USB_MICRO-B = smd 0.4 x 2: P$1 -1.3,2.475; P$2 -0.65,2.475; P$3 0,2.475; P$4 0.65,2.475; P$5 1.3,2.475 | smd 2.1 x 1.6: P$6 -3.1,2.675; P$7 3.1,2.675 | smd 1.9 x 1.8: P$8 -3.525,0; P$9 3.525,0
USB_A_SMT = smd 4 x 0.9: D+ 6.7,-1; D- 6.7,1; GND 6.7,-3.5; VBUS 6.7,3.5 | drill 2: SHLD1 3,-6.566; SHLD2 3,6.566
RJ45_TH_ELEC = drill 1 square: 1 -4.45,-2.54 | drill 1: 2 -3.18,0; 3 -1.91,-2.54; 4 -0.635,0; 5 0.635,-2.54; 6 1.91,0; 7 3.17,-2.54; 8 4.445,0; 9 -6.63,-13.88; 10 -4.09,-13.88; 11 4.09,-13.88; 12 6.63,-13.88 | drill 1.5: 13 -7.75,-5.84; 14 7.75,-5.84 | hole 3.299: 5.715,-8.89; -5.715,-8.89
2_X_10_.1_INCH = drill 1: P$1 -11.43,-1.27; P$2 -11.43,1.27; P$3 -8.89,-1.27; P$4 -8.89,1.27; P$5 -6.35,-1.27; P$6 -6.35,1.27; P$7 -3.81,-1.27; P$8 -3.81,1.27; P$9 -1.27,-1.27; P$10 -1.27,1.27; P$11 1.27,-1.27; P$12 1.27,1.27; P$13 3.81,-1.27; P$14 3.81,1.27; P$15 6.35,-1.27; P$16 6.35,1.27; P$17 8.89,-1.27; P$18 8.89,1.27; P$19 11.43,-1.27; P$20 11.43,1.27
2X5 = drill 1 pad 1.88: 1 0,0; 2 0,2.54; 3 2.54,0; 4 2.54,2.54; 5 5.08,0; 6 5.08,2.54; 7 7.62,0; 8 7.62,2.54; 9 10.16,0; 10 10.16,2.54
SD_CARD = smd 0.7 x 1.75: 1 3.2,-0.875; 2 2.1,-0.875; 3 1,-0.875; 4 -0.1,-0.875; 5 -1.2,-0.875; 6 -2.3,-0.875; 7 -3.4,-0.875; 8 -4.5,-0.875 | smd 1 x 1.55: 9 5.575,9.925 | smd 1.45 x 1: 10 -5.625,8.35 | smd 1.5 x 1.5: S1 5.65,-0.75 | smd 1.3 x 1.5: S2 -5.7,-0.75 | smd 0.8 x 1.4: S3 5.975,7.5 | smd 0.8 x 1.5: S4 -5.95,6.85
HEADER_2_X_20_.1_INCH = drill 1: P$1 -24.13,-1.27; P$2 -24.13,1.27; P$3 -21.59,-1.27; P$4 -21.59,1.27; P$5 -19.05,-1.27; P$6 -19.05,1.27; P$7 -16.51,-1.27; P$8 -16.51,1.27; P$9 -13.97,-1.27; P$10 -13.97,1.27; P$11 -11.43,-1.27; P$12 -11.43,1.27; P$13 -8.89,-1.27; P$14 -8.89,1.27; P$15 -6.35,-1.27; P$16 -6.35,1.27; P$17 -3.81,-1.27; P$18 -3.81,1.27; P$19 -1.27,-1.27; P$20 -1.27,1.27; P$21 1.27,-1.27; P$22 1.27,1.27; P$23 3.81,-1.27; P$24 3.81,1.27; P$25 6.35,-1.27; P$26 6.35,1.27; P$27 8.89,-1.27; P$28 8.89,1.27; P$29 11.43,-1.27; P$30 11.43,1.27; P$31 13.97,-1.27; P$32 13.97,1.27; P$33 16.51,-1.27; P$34 16.51,1.27; P$35 19.05,-1.27; P$36 19.05,1.27; P$37 21.59,-1.27; P$38 21.59,1.27; P$39 24.13,-1.27; P$40 24.13,1.27
1008 = smd 3 x 1.1: 1 0,1.1; 2 0,-1.1
0805 = smd 1.3 x 1.5: 1 -0.95,0; 2 0.95,0
SOT-23-5 = smd 1.626 x 0.61: 1 -1.245,0.95; 2 -1.245,0; 3 -1.245,-0.95; 4 1.245,-0.95; 5 1.245,0.95
QFN-24-M = smd 0.864 x 0.305: 1 -1.968,1.25; 2 -1.968,0.75; 3 -1.968,0.25; 4 -1.968,-0.25; 5 -1.968,-0.75; 6 -1.968,-1.25; 13 1.968,-1.25; 14 1.968,-0.75; 15 1.968,-0.25; 16 1.968,0.25; 17 1.968,0.75; 18 1.968,1.25 | smd 0.305 x 0.864: 7 -1.25,-1.968; 8 -0.75,-1.968; 9 -0.25,-1.968; 10 0.25,-1.968; 11 0.75,-1.968; 12 1.25,-1.968; 19 1.25,1.968; 20 0.75,1.968; 21 0.25,1.968; 22 -0.25,1.968; 23 -0.75,1.968; 24 -1.25,1.968 | smd 2.743 x 2.743: 25 0,0
LQFP176_24X24 = smd 1.372 x 0.254: 1 -12.675,10.75; 2 -12.675,10.25; 3 -12.675,9.75; 4 -12.675,9.25; 5 -12.675,8.75; 6 -12.675,8.25; 7 -12.675,7.75; 8 -12.675,7.25; 9 -12.675,6.75; 10 -12.675,6.25; 11 -12.675,5.75; 12 -12.675,5.25; 13 -12.675,4.75; 14 -12.675,4.25; 15 -12.675,3.75; 16 -12.675,3.25; 17 -12.675,2.75; 18 -12.675,2.25; 19 -12.675,1.75; 20 -12.675,1.25; 21 -12.675,0.75; 22 -12.675,0.25; 23 -12.675,-0.25; 24 -12.675,-0.75; 25 -12.675,-1.25; 26 -12.675,-1.75; 27 -12.675,-2.25; 28 -12.675,-2.75; 29 -12.675,-3.25; 30 -12.675,-3.75; 31 -12.675,-4.25; 32 -12.675,-4.75; 33 -12.675,-5.25; 34 -12.675,-5.75; 35 -12.675,-6.25; 36 -12.675,-6.75; 37 -12.675,-7.25; 38 -12.675,-7.75; 39 -12.675,-8.25; 40 -12.675,-8.75; 41 -12.675,-9.25; 42 -12.675,-9.75; 43 -12.675,-10.25; 44 -12.675,-10.75; 89 12.675,-10.75; 90 12.675,-10.25; 91 12.675,-9.75; 92 12.675,-9.25; 93 12.675,-8.75; 94 12.675,-8.25; 95 12.675,-7.75; 96 12.675,-7.25; 97 12.675,-6.75; 98 12.675,-6.25; 99 12.675,-5.75; 100 12.675,-5.25; 101 12.675,-4.75; 102 12.675,-4.25; 103 12.675,-3.75; 104 12.675,-3.25; 105 12.675,-2.75; 106 12.675,-2.25; 107 12.675,-1.75; 108 12.675,-1.25; 109 12.675,-0.75; 110 12.675,-0.25; 111 12.675,0.25; 112 12.675,0.75; 113 12.675,1.25; 114 12.675,1.75; 115 12.675,2.25; 116 12.675,2.75; 117 12.675,3.25; 118 12.675,3.75; 119 12.675,4.25; 120 12.675,4.75; 121 12.675,5.25; 122 12.675,5.75; 123 12.675,6.25; 124 12.675,6.75; 125 12.675,7.25; 126 12.675,7.75; 127 12.675,8.25; 128 12.675,8.75; 129 12.675,9.25; 130 12.675,9.75; 131 12.675,10.25; 132 12.675,10.75 | smd 0.254 x 1.372: 45 -10.75,-12.675; 46 -10.25,-12.675; 47 -9.75,-12.675; 48 -9.25,-12.675; 49 -8.75,-12.675; 50 -8.25,-12.675; 51 -7.75,-12.675; 52 -7.25,-12.675; 53 -6.75,-12.675; 54 -6.25,-12.675; 55 -5.75,-12.675; 56 -5.25,-12.675; 57 -4.75,-12.675; 58 -4.25,-12.675; 59 -3.75,-12.675; 60 -3.25,-12.675; 61 -2.75,-12.675; 62 -2.25,-12.675; 63 -1.75,-12.675; 64 -1.25,-12.675; 65 -0.75,-12.675; 66 -0.25,-12.675; 67 0.25,-12.675; 68 0.75,-12.675; 69 1.25,-12.675; 70 1.75,-12.675; 71 2.25,-12.675; 72 2.75,-12.675; 73 3.25,-12.675; 74 3.75,-12.675; 75 4.25,-12.675; 76 4.75,-12.675; 77 5.25,-12.675; 78 5.75,-12.675; 79 6.25,-12.675; 80 6.75,-12.675; 81 7.25,-12.675; 82 7.75,-12.675; 83 8.25,-12.675; 84 8.75,-12.675; 85 9.25,-12.675; 86 9.75,-12.675; 87 10.25,-12.675; 88 10.75,-12.675; 133 10.75,12.675; 134 10.25,12.675; 135 9.75,12.675; 136 9.25,12.675; 137 8.75,12.675; 138 8.25,12.675; 139 7.75,12.675; 140 7.25,12.675; 141 6.75,12.675; 142 6.25,12.675; 143 5.75,12.675; 144 5.25,12.675; 145 4.75,12.675; 146 4.25,12.675; 147 3.75,12.675; 148 3.25,12.675; 149 2.75,12.675; 150 2.25,12.675; 151 1.75,12.675; 152 1.25,12.675; 153 0.75,12.675; 154 0.25,12.675; 155 -0.25,12.675; 156 -0.75,12.675; 157 -1.25,12.675; 158 -1.75,12.675; 159 -2.25,12.675; 160 -2.75,12.675; 161 -3.25,12.675; 162 -3.75,12.675; 163 -4.25,12.675; 164 -4.75,12.675; 165 -5.25,12.675; 166 -5.75,12.675; 167 -6.25,12.675; 168 -6.75,12.675; 169 -7.25,12.675; 170 -7.75,12.675; 171 -8.25,12.675; 172 -8.75,12.675; 173 -9.25,12.675; 174 -9.75,12.675; 175 -10.25,12.675; 176 -10.75,12.675
SMD_3225 = smd 1.6 x 1.4: 1 -1.2,-0.9; 2 1.2,-0.9; 3 1.2,0.9; 4 -1.2,0.9
SMD_X_2_PADS = smd 1.9 x 1.1: P$1 0,1.25; P$2 0,-1.25

### Placement (x,y rotation side)
C1  35.85,35.95 0 bottom
C2  34.85,35.94 0 bottom
C5  30.1,71.55 180 top
C8  31.2,71.55 180 top
C10  26.8,26.22 0 bottom
C11  31.7,76.9 90 top
C13  20.31,26.21 0 bottom
C14  33.03,26.22 0 bottom
C15  31.1,74.3 0 top
C16  15,83.6 90 top
C30  36.65,42.09 180 bottom
C31  16.1,37.65 270 bottom
C32  18.56,27.16 270 bottom
C33  52.5,69.65 270 bottom
C34  52.5,71.7 270 bottom
C35  52.5,70.7 270 bottom
C36  26.89,18.08 180 bottom
C37  36.38,31.86 270 bottom
C38  27.98,51.93 90 top
C39  43.44,84.93 180 bottom
C40  42.16,84.93 180 bottom
C41  44.09,62.63 180 bottom
C42  44.09,60.02 0 bottom
C43  41.54,67.52 180 bottom
C44  39.91,67.52 180 bottom
C45  38.88,67.52 180 bottom
C46  37.6,67.52 180 bottom
C47  38.24,60.54 270 bottom
C48  28.05,62 0 bottom
C49  29.4,62 0 bottom
C50  27.86,53.03 90 top
C51  24.97,51.93 270 top
C52  23.8,52.97 90 top
C53  21.87,52.5 0 top
C54  35.74,27.08 270 bottom
C55  36.87,35.96 0 bottom
C56  34.2,31.85 270 bottom
C57  15.72,34.15 180 bottom
C58  25.24,44.01 0 bottom
C59  17.34,34.76 90 bottom
C60  20.91,44.05 0 bottom
C61  17.71,44.06 180 bottom
FB2/2  43.78,67.67 270 bottom
J1  56,70 90 top
J2  13,90.3 180 top
J3  25,84.6 270 top
J4  42.8,72.2 180 top
J5  55.9,51 90 top
J6  6,72 90 top
J7  5,49 90 top
J9  57,19.4 90 top
J10  30,3.5 180 top
J11  6,17 90 top
J12  57.1,33 180 top
L3  52,74.2 90 bottom
LED3  49.2,67.2 90 top
R1  26.4,69.3 90 top
R4  14.4,81.6 180 top
R5  13.3,81.6 180 top
R6  12.3,81.6 180 top
R7  15,84.7 270 top
R12  28.4,70.8 90 top
R13  51.88,67.91 180 top
R16  16.11,35.72 90 bottom
R17  16.12,36.68 90 bottom
R18  17.42,33.58 270 bottom
R19  23.69,49.5 90 top
R20  37.85,24.92 0 bottom
R21  36.87,24.92 0 bottom
R23  36.11,88.12 180 bottom
R24  49.46,88.17 180 bottom
R25  38.22,59.54 90 bottom
R26  33.84,35.93 0 bottom
R27  35.46,43.28 0 bottom
R28  38.17,57.59 270 bottom
R29  38.22,58.56 270 bottom
R30  32.05,61.45 180 bottom
R31  30.4,62.05 180 bottom
R32  29.05,67.4 270 bottom
R33  28.4,65.1 270 bottom
U2  26.8,73.5 90 top
U3  33.6,65.45 0 bottom
U4  26.7,35.3 270 top
U5  47.15,61.19 90 bottom
U$4  34.39,43.3 0 bottom
X3  27.9,54.74 270 top
X4  22.69,56.11 180 top

### Tracks (layer width: path | path; a pad name or v marks a point on that pad's centre or on a via)
C58
  Bottom 0.254: J4.4 43.44,84.6 C39.P$1
C60
  Bottom 0.254: J4.5 42.16,84.6 C40.P$1
CRS_DV
  Bottom 0.254: U3.15 29.1,65.2 R33.P$2
D+
  Top 0.406: R6.P$2 12.3,82.93 13,83.73 J2.P$3
D-
  Top 0.406: R5.P$2 13.3,83.2 13.65,83.55 J2.P$2
ETH  (via drill 0.35)
  Top 0.254: v29.05,66.25 31.85,66.25 33.45,64.65 U4.9
  Bottom 0.254: U3.16 29.6,65.7 v29.05,66.25
ETH_CRS_DV  (via drill 0.35)
  Top 0.254: v28,63.75 28,60.6 31.45,57.15 U4.13
  Bottom 0.254: v28,63.75 27.95,63.75 27.8,63.9 R33.P$1
ETH_IRQ14  (via drill 0.35)
  Top 0.254: v41.45,59.2 40.2,59.2 39.9,59.5 39.9,70 39.45,70.45 32.75,70.45 31.35,69.05 30.65,69.05 30.55,68.95 v30.55,67.4 | U4.159 41.45,37.55 v41.7,37.3
  Bottom 0.254: v41.45,59.2 41.65,59.2 43.1,57.75 43.1,38.7 v41.7,37.3 41.2,37.8 34.41,37.8 33.84,37.23 R26.P$1 | U3.18 30.9,66.7 30.55,67.05 v30.55,67.4
ETH_MDC  (via drill 0.35)
  Top 0.254: U4.4 35.95,57.14 v36.4,57.59
  Bottom 0.254: U3.11 32.85,59.75 35.01,57.59 v36.4,57.59 R28.P$1
ETH_MDIO  (via drill 0.35)
  Top 0.254: U4.5 35.45,58.4 v35.61,58.56
  Bottom 0.254: U3.10 33.35,60.7 35.49,58.56 v35.61,58.56 R29.P$1
ETH_RESET  (via drill 0.35)
  Top 0.254: v37.15,69.7 39.15,69.7 39.45,69.4 39.45,59.35 40.5,58.3 v40.75,58.3 | U4.172 42.15,44.05 v42.4,43.8
  Bottom 0.254: U3.24 34.85,67.75 36.8,69.7 v37.15,69.7 | U$4.P$1 35.44,43.9 R27.P$1 35.63,44.05 42.15,44.05 v42.4,43.8 42.65,44.05 42.65,57.3 41.65,58.3 v40.75,58.3
ETH_RX_ER  (via drill 0.35)
  Top 0.254: v28,66.2 28.74,65.46 28.74,60.53 31.95,57.32 U4.12
  Bottom 0.254: R32.P$1 28,66.95 v28,66.2
ETH_RXD0  (via drill 0.35)
  Top 0.254: v31.05,60.3 32.15,60.3 32.95,59.5 U4.10
  Bottom 0.254: v31.05,60.3 30.4,60.95 R31.P$1
ETH_RXD1  (via drill 0.35)
  Top 0.254: U4.11 32.45,58.42 32.2,58.75 v32.2,58.8
  Bottom 0.254: R30.P$1 32.2,60.7 v32.2,58.8
ETH_TXD0  (via drill 0.35)
  Top 0.254: v32.75,68.9 32.75,66 33.95,64.8 U4.8
  Bottom 0.254: U3.20 32.85,68.8 v32.75,68.9
ETH_TXD1  (via drill 0.35)
  Top 0.254: v33.6,68.55 33.6,65.95 34.45,65.1 U4.7
  Bottom 0.254: U3.21 33.35,68.3 v33.6,68.55
ETH_TXD_EN  (via drill 0.35)
  Top 0.254: v31.45,68.35 31.45,68.55 32.5,69.6 33.58,69.6 34.39,68.79 34.39,66.06 34.95,65.5 U4.6
  Bottom 0.254: U3.19 32.35,68.02 32.02,68.35 v31.45,68.35
GND  (via drill 0.35)  (103 unrouted)
  Bottom 0.254: v26.9,16.1 C36.P$1
  other vias: 40.6,36.3 47,68.4 25.3,60.7 19.7,67.3 19.8,60.9 46,46.2 40.1,47.5 51.3,26.7 14.1,73.4 23.4,46 24.7,36.4 33.5,38.8 32.9,29.1
  pour Top (no thermals): 60,0 0,0 0,91.9 60,91.9
  pour Bottom (no thermals): 60,0 0,0 0,91.9 60,91.9
GNDE  (via drill 0.35)  (2 unrouted)
  Top 0.254: J9.S3 57.42,25.38 J9.S1 57.7,25.1 v57.7,26.7 58.76,27.76 58.76,79.9 57.23,81.43 J1.P$4 | J9.S4 57.5,13.45 J9.S2 57.75,12.45 v57.8,12.4
  Top 0.813: J2.P$9 9.47,88.05 J2.P$7
  Top 1.016: J2.P$9 J2.P$8 16.52,87.62 J2.P$6 17.68,87.62 18.43,86.87 J3.SHLD1 | J3.SHLD2 31.49,81.6 J4.14
  Bottom 0.254: v57.8,12.4 57.8,26.6 v57.7,26.7
  Bottom 1.016: J1.P$4 53.94,81.43 J4.13
IIC_1_SCL  (via drill 0.35)
  Top 0.254: U4.132 37.45,20.71 v37.85,20.32 38.65,19.52 38.65,14.9 48.78,4.77 J10.P$5
  Bottom 0.254: R20.P$2 v37.85,20.32
IIC_1_SDA  (via drill 0.35)
  Top 0.254: U4.131 36.95,19.43 v37.17,19.21 37.17,15.71 47.7,5.18 47.7,3.58 J10.P$6
  Bottom 0.254: v37.17,19.21 36.97,19.41 36.97,24.21 R21.P$2
INT_MI_01  (via drill 0.35)
  Top 0.254: v9.14,16.26 9.14,13.21 6.77,10.85 6.77,5.67 J10.P$39 | U4.87 12.62,25.05 11.38,23.81 v10.3,23.81
  Bottom 0.254: v9.14,16.26 10.34,17.46 10.34,23.77 v10.3,23.81
INT_MI_02  (via drill 0.35)
  Top 0.254: U4.86 11.95,25.55 v11.1,24.7 | J10.P$40 5.86,2.23 4.4,3.69 4.4,5.3 6.24,7.14 6.24,11.24 8.4,13.4 v8.4,15.6
  Bottom 0.254: v11.1,24.7 11.1,17.2 9.5,15.6 v8.4,15.6
INT_MI_03
  Top 0.254: U4.128 35.45,13.25 43.93,4.77 J10.P$9
INT_MI_04
  Top 0.254: J10.P$10 42.67,3.53 42.67,5.11 34.95,12.83 U4.127
LED1/SPEED
  Bottom 0.254: U3.23 34.35,67.9 36.4,69.95 36.4,74.67 40.51,78.78 40.51,84.28 J4.11
N$1  (via drill 0.35)
  Top 0.254: U4.148 41,32.05 v41.6,32.65
  Bottom 0.254: v41.6,32.65 41,32.05 37.17,32.05 C37.P$2
N$3
  Top 0.508: R13.P$1 51.88,67.11 51.02,66.25 LED3.1
N$4
  Top 0.254: C38.P$1 27.38,51.03 28.45,49.95 U4.19
N$5  (via drill 0.35)
  Top 0.254: v12.05,37.5 12.1,37.55 U4.62
  Bottom 0.254: v12.05,37.5 12.1,37.55 15.4,37.55 C31.P$1
N$6  (via drill 0.35)
  Top 0.254: v12,36.5 12.05,36.55 U4.64
  Bottom 0.254: v12,36.5 12.05,36.55 15.4,36.56 R17.P$2
N$7  (via drill 0.35)
  Top 0.254: v11.7,35.6 12.07,35.6 12.53,36.05 U4.65
  Bottom 0.254: v11.7,35.6 12.1,35.6 12.47,35.98 14.46,35.98 14.71,35.73 R16.P$2
N$8
  Top 0.254: U4.27 24.45,49.31 24.46,49.33 R19.P$2
P0_00
  Top 0.254: U4.169 43.05,42.55 46.03,39.57 J5.P$2
P0_01
  Top 0.254: J5.P$1 55.97,38.37 46.57,38.37 42.89,42.05 U4.168
P0_02
  Top 0.254: U4.167 42.65,41.55 48.7,35.5 55.25,35.5 57.1,33.65 J12.1
P0_03
  Top 0.254: U4.166 42.55,41.05 48.6,35 53.15,35 54.56,33.59 J12.3
P0_04
  Top 0.254: U4.165 42.45,40.55 48.45,34.55 50.47,34.55 J12.5
P0_05
  Top 0.254: U4.164 42.35,40.05 49.4,33 J12.7
P0_06
  Top 0.254: U4.163 39.42,39.59 42.2,39.59 44.74,37.05 44.74,35.2 J12.9
P0_07
  Top 0.254: U4.162 42.15,39.05 44.3,36.9 44.3,31.8 45.64,30.46 J12.10
P0_08  (via drill 0.35)
  Top 0.254: U4.161 42.05,38.55 42.85,37.75 42.85,36.6 42.97,36.48 v42.97,34.78 42.97,31.93 47.1,27.8 49.3,27.8 49.48,27.98 J12.8
P0_09  (via drill 0.35)
  Top 0.254: v42.13,35.23 42.41,35.51 42.41,37.52 41.88,38.05 U4.160
  Bottom 0.254: v42.13,35.23 42.23,35.13 42.23,34.37 43.8,32.8 43.8,31.3 46.5,28.6 52.02,28.6 J12.6
P0_14  (via drill 0.35)
  Top 0.254: U4.152 40.5,34.05 40.95,34.5 v41.4,34.5
  Bottom 0.254: v41.4,34.5 41.38,34.5 43.19,32.69 43.19,31.19 46.27,28.1 54.56,28.1 J12.4
P0_15  (via drill 0.35)
  Top 0.254: v41.3,33.56 v41.29,33.55 U4.151
  Bottom 0.254: v41.3,33.56 41.62,33.56 42.59,32.59 42.59,31.21 46.3,27.5 57.1,27.5 J12.2
P1_02
  Top 0.254: U4.130 36.45,14.9 46.51,4.84 J10.P$7
P1_03
  Top 0.254: J10.P$8 45.28,3.46 45.28,5.3 35.94,14.63 35.94,22.62 U4.129
P1_06
  Top 0.254: U4.126 34.45,11.75 J10.P$11
P1_07
  Top 0.254: J10.P$12 41.4,2.23 40.21,3.42 40.21,5.12 33.95,11.38 U4.125
P1_11
  Top 0.254: U4.92 17.45,20.95 7.3,10.8 7.3,3.34 J10.P$38
P1_12
  Top 0.254: U4.93 17.95,20.85 8.41,11.31 J10.P$37
P1_13
  Top 0.254: U4.94 18.45,20.65 9.6,11.8 9.6,3.58 J10.P$36
P1_14
  Top 0.254: U4.95 18.95,20.55 10.95,12.55 J10.P$35
P1_15
  Top 0.254: U4.96 19.45,21.58 19.44,21.57 19.44,20.44 12.3,13.3 12.3,3.42 J10.P$34
P2_00  (via drill 0.35)
  Top 0.254: U4.69 11.54,34.05 10.59,35 10.59,35.8 v10.34,36.05
  Bottom 0.254: v10.34,36.05 9.25,37.14 9.25,51.55 7.99,52.81 J7.P$13
P2_01  (via drill 0.35)
  Top 0.254: U4.68 12.93,34.55 12.92,34.54 11.63,34.54 11.04,35.13 11.04,36.3 v10.34,37
  Bottom 0.254: v10.34,37 9.7,37.64 9.7,52.4 8,54.1 5,54.1 3.73,52.83 J7.P$14
P2_02
  Top 0.254: U4.54 11.7,41.55 9.27,43.98 9.27,58.93 7.77,60.43 J7.P$19
P2_03
  Top 0.254: U4.53 11.78,42.05 9.68,44.14 9.68,70.82 8.5,72 J6.1
P2_04
  Top 0.254: U4.52 11.9,42.55 10.09,44.36 10.09,73.2 8.75,74.54 J6.3
P2_05
  Top 0.254: U4.51 12.05,43.05 10.5,44.6 10.5,75.8 9.22,77.08 J6.5
P2_06
  Top 0.254: U4.50 12.17,43.55 10.95,44.77 10.95,78.25 9.58,79.62 J6.7
P2_07
  Top 0.254: U4.49 12.3,44.05 11.4,44.95 11.4,80.3 9.5,82.2 6.04,82.2 J6.9
P3_03
  Top 0.254: U4.85 9.07,26.05 6.27,28.85 6.27,33.53 3.73,36.07 J7.P$2
P3_04
  Top 0.254: U4.82 8.15,27.55 6.67,29.02 6.67,33.83 4.9,35.6 4.9,38.94 J7.P$4
P3_05  (via drill 0.35)
  Top 0.254: U4.81 8.23,28.04 7.08,29.19 7.08,34.82 v6.6,35.3
  Bottom 0.254: v6.6,35.3 4.9,37 4.9,41.48 J7.P$6
P3_06
  Top 0.254: U4.80 8.29,28.55 7.49,29.36 7.49,36.35 J7.P$1
P3_07
  Top 0.254: U4.79 8.37,29.05 7.89,29.53 7.89,39.31 7.09,40.11 J7.P$3
P3_09
  Top 0.254: U4.77 9.26,30.05 8.3,31.01 8.3,42 7.6,42.7 6.32,42.7 J7.P$5
P3_10  (via drill 0.35)
  Top 0.254: U4.76 9.75,30.55 v9.36,30.94
  Bottom 0.254: v9.36,30.94 8.96,30.94 7.54,32.36 7.54,44.2 6.55,45.19 J7.P$7
P3_11  (via drill 0.35)
  Top 0.254: v9.05,31.85 9.5,31.85 10.3,31.05 U4.75
  Bottom 0.254: v9.05,31.85 7.94,32.95 7.94,45.46 7,46.4 4.94,46.4 J7.P$8
P3_12
  Top 0.254: J7.P$9 6.66,47.73 7.59,46.8 7.59,43.3 8.79,42.1 8.79,33.13 10.38,31.55 U4.74
P3_13
  Top 0.254: U4.55 11.62,41.05 8.81,43.87 8.81,57.89 7.5,59.2 4.96,59.2 J7.P$20
P3_14
  Top 0.254: U4.56 11.55,40.55 8.4,43.7 8.4,57.2 7.71,57.89 J7.P$17
P3_15  (via drill 0.35)
  Top 0.254: v11.22,39.92 11.35,40.05 U4.57
  Bottom 0.254: v11.22,39.92 11.22,39.86 11.15,39.79 11.15,55.5 7.55,59.1 4.94,59.1 J7.P$18
P4_00
  Top 0.254: U4.1 37.45,48.75 37.7,49 48.69,49 51.7,45.99 55.97,45.99 J5.P$7
P4_01
  Top 0.254: U4.2 36.95,48.95 37.6,49.6 49.39,49.6 51.8,47.19 J5.P$8
P4_02
  Top 0.254: U4.3 36.45,49.05 37.5,50.1 50.13,50.1 51.6,48.63 56.07,48.63 J5.P$9
P4_08  (via drill 0.35)
  Top 0.254: U4.43 16.45,55.8 v16.65,56 | v39.8,57.5 40.9,57.5 41.8,58.4 49.27,58.4 53.3,62.43 J5.P$20
  Bottom 0.254: v16.65,56 16.65,56.05 17.06,56.46 38.81,56.46 39.8,57.45 v39.8,57.5
P4_09  (via drill 0.35)
  Top 0.254: U4.42 16.95,54.89 v17.15,55.09 | v39.81,56.53 40.52,56.53 41.68,57.7 50.57,57.7 54.1,61.23 55.97,61.23 J5.P$19
  Bottom 0.254: v17.15,55.09 17.5,55.09 18.46,56.05 39.33,56.05 v39.81,56.53
P4_10  (via drill 0.35)
  Top 0.254: U4.41 17.45,54.02 v17.61,54.18 | v41.92,56.9 v41.93,56.89 51.03,56.89 54.03,59.89 J5.P$18
  Bottom 0.254: v17.61,54.18 19.06,55.63 39.89,55.63 41.16,56.9 v41.92,56.9
P4_11  (via drill 0.35)
  Top 0.254: U4.40 17.95,53.44 v18.2,53.44 | v41.99,55.8 50.99,55.8 53.78,58.59 55.87,58.59 J5.P$17
  Bottom 0.254: v18.2,53.44 18.25,53.44 20.01,55.2 40.19,55.2 40.79,55.8 v41.99,55.8
P4_12  (via drill 0.35)
  Top 0.254: J5.P$16 53.55,57.35 51.14,54.94 v41.2,54.94 | v18.61,52.5 18.45,52.5 U4.39
  Bottom 0.254: v18.61,52.5 20.85,54.74 41,54.74 v41.2,54.94
P4_13  (via drill 0.35)
  Top 0.254: U4.38 18.95,51.31 19.14,51.5 v19.14,51.7 | v41.97,54.13 51.2,54.13 53.23,56.15 55.97,56.15 J5.P$15
  Bottom 0.254: v19.14,51.7 21.73,54.28 41.81,54.28 v41.97,54.13
P4_14  (via drill 0.35)
  Top 0.254: J5.P$14 53.31,54.81 51.97,53.47 41.5,53.47 41.37,53.6 v40.8,53.6 | v19.91,51.01 19.45,50.55 U4.37
  Bottom 0.254: v40.8,53.6 40.55,53.85 22.75,53.85 v19.91,51.01
P4_15  (via drill 0.35)
  Top 0.254: U4.36 19.95,49.82 v20.24,50.11 | v41.7,52.8 52.26,52.8 52.97,53.51 55.87,53.51 J5.P$13
  Bottom 0.254: v20.24,50.11 20.24,50.31 23.32,53.39 39.88,53.39 40.33,52.94 41.56,52.94 v41.7,52.8
P5_11
  Top 0.254: U4.176 43.63,46.05 45.03,44.65 J5.P$6
P5_12
  Top 0.254: U4.175 39.41,45.52 43.32,45.52 45.9,43.35 55.87,43.35 J5.P$5
P5_13
  Top 0.254: U4.174 42.99,45.05 45.93,42.11 J5.P$4
P6_00
  Top 0.254: U4.122 32.45,11.2 J10.P$13
P6_01
  Top 0.254: J10.P$14 37.58,3.54 37.58,5.19 31.95,10.82 U4.121
P6_02
  Top 0.254: U4.120 31.45,9.65 36.33,4.77 J10.P$15
P6_03
  Top 0.254: J10.P$16 35.1,3.48 35.1,5.22 30.95,9.37 U4.119
P6_04
  Top 0.254: U4.118 30.45,8.25 33.81,4.89 J10.P$17
P6_05
  Top 0.254: J10.P$18 33.78,2.23 32.48,3.53 32.48,5.17 29.95,7.7 U4.117
P6_06
  Top 0.254: U4.116 29.45,7.55 31.27,5.73 J10.P$19
P6_07
  Top 0.254: J10.P$20 30,3.5 30,6.4 28.95,7.45 U4.115
P6_08
  Top 0.254: U4.99 20.95,21.1 13.49,13.64 J10.P$33
P6_09
  Top 0.254: U4.100 21.45,20.95 14.8,14.3 14.8,3.46 J10.P$32
P6_10
  Top 0.254: U4.101 21.95,20.85 16.03,14.93 J10.P$31
P6_11
  Top 0.254: J10.P$30 17.24,3.56 17.24,15.54 22.45,20.75 U4.102
P6_12
  Top 0.254: U4.103 22.95,20.65 18.57,16.27 J10.P$29
P6_13
  Top 0.254: J10.P$28 19.8,3.54 19.8,16.9 23.45,20.55 U4.104
P6_14
  Top 0.254: U4.105 23.95,20.45 21.11,17.61 J10.P$27
P6_15
  Top 0.254: U4.106 24.45,20.35 22.35,18.25 22.35,3.53 J10.P$26
P7_06  (via drill 0.35)
  Top 0.254: U4.14 30.95,50.59 v30.79,50.75 | v41.4,50.88 51.92,50.88 53.07,49.73 J5.P$10
  Bottom 0.254: v30.79,50.75 41.27,50.75 v41.4,50.88
P7_07  (via drill 0.35)
  Top 0.254: U4.15 30.45,49.3 30.12,49.63 30.12,51.16 30.68,51.72 v30.78,51.72 | J5.P$11 56.67,52.27 55.44,51.04 53.06,51.04 52.4,51.7 v40.7,51.7
  Bottom 0.254: v30.78,51.72 30.8,51.7 v40.7,51.7
P8_00
  Top 0.254: U4.133 39.38,23.55 41.27,21.65 41.27,13.08 48.16,6.2 49.55,6.2 50.26,5.49 50.26,4.04 51.59,2.71 J10.P$4
P8_01
  Top 0.254: U4.134 40.17,25.05 41.83,23.4 41.83,13.2 48.23,6.79 50.61,6.79 51.59,5.81 J10.P$3
P8_02
  Top 0.254: J10.P$2 52.85,3.51 52.85,5.65 50.85,7.65 48.05,7.65 42.33,13.38 42.33,23.55 40.33,25.55 U4.135
P8_03  (via drill 0.35)
  Top 0.254: U4.136 40.85,26.05 v41.35,25.55
P8_04  (via drill 0.35)
  Top 0.254: U4.137 41.29,26.55 42.05,25.79 v42.05,24.79
P8_05
  Top 0.254: U4.173 42.85,44.55 46.5,40.9 55.96,40.9 J5.P$3
P9_00  (via drill 0.35)
  Top 0.254: v11.01,38.65 11.91,39.55 U4.58
  Bottom 0.254: v11.01,38.65 10.96,38.65 10.56,39.05 10.56,53.64 7.5,56.7 5.08,56.7 J7.P$16
P9_01  (via drill 0.35)
  Top 0.254: v10.41,37.95 11.26,37.95 12.36,39.05 U4.59
  Bottom 0.254: v10.41,37.95 10.15,38.21 10.15,53.05 7.85,55.35 J7.P$15
P9_05
  Top 0.254: U4.73 10.45,32.05 9.2,33.3 9.2,42.3 8,43.5 8,48 6.9,49.1 5.1,49.1 J7.P$10
P9_06  (via drill 0.35)
  Top 0.254: U4.72 11.03,32.54 v9.94,33.63
  Bottom 0.254: v9.94,33.63 8.35,35.22 8.35,49.25 7.33,50.27 J7.P$11
P9_07  (via drill 0.35)
  Top 0.254: U4.71 11.6,33.05 9.9,34.75 v9.9,35.2
  Bottom 0.254: v9.9,35.2 8.8,36.3 8.8,45.5 8.79,45.49 8.79,50.95 8.14,51.6 5.06,51.6 J7.P$12
PA_00
  Top 0.254: J10.P$21 28.73,6.84 28.45,7.12 U4.114
PA_01
  Top 0.254: J10.P$22 28.73,2.24 27.6,3.37 27.6,17.82 27.96,18.18 27.96,22.28 27.95,22.29 U4.113
PA_08
  Top 0.254: J10.P$25 23.65,18.92 24.95,20.22 U4.107
PA_09
  Top 0.254: J10.P$24 24.96,3.46 24.96,19.6 25.45,20.09 U4.108
PA_10
  Top 0.254: U4.109 25.95,5.01 J10.P$23
PB_00  (via drill 0.35)
  Top 0.254: v39.9,52.44 41.13,52.44 41.43,52.14 54.63,52.14 J5.P$12 | v30.79,52.71 29.7,51.62 29.7,49.42 29.95,49.17 U4.16
  Bottom 0.254: v39.9,52.44 31.47,52.44 31.19,52.71 v30.79,52.71
R51
  Bottom 0.254: R23.P$1 36.11,86.14 J4.12
R52
  Bottom 0.254: J4.9 49.46,86.11 R24.P$1
RESET  (via drill 0.35)
  Top 0.254: v12.65,35.2 12.8,35.05 U4.67
  Bottom 0.254: J11.9 7.9,27.16 13.1,32.36 13.1,33.55 C57.P$1 | v12.65,35.2 12.65,34.1 13.2,33.55 C57.P$1 | C57.P$1 16.79,33.55 R18.P$1
REXT
  Bottom 0.254: U3.9 33.85,61.29 34.82,60.54 C47.P$1 37.62,60.52 R25.P$2
RXD0
  Bottom 0.254: R31.P$2 30.4,63.77 30.83,64.2 U3.13
RXD1
  Bottom 0.254: U3.12 32.35,62.9 32.05,62.6 R30.P$2
RXER
  Bottom 0.254: U3.17 30.25,66.2 29.65,66.8 R32.P$2
RXM
  Bottom 0.254: J4.6 41.99,71.1 44.75,71.1 45.2,70.65 45.2,66.25 44.65,65.7 U3.3
RXP
  Bottom 0.254: U3.4 45.05,65.2 45.81,65.96 45.81,70.74 44.71,71.84 J4.3
SD1_CD
  Top 0.254: U4.146 42.55,31.05 43.85,29.75 43.85,28.45 44.4,27.9 44.4,27.12 44.43,27.1 44.43,22.52 45.05,21.9 45.05,14.45 45.73,13.78 J9.10
SD1_CLK  (via drill 0.35)
  Top 0.254: v43,18.05 42.75,18.3 42.75,26.38 41.07,28.06 39.38,28.06 U4.140 | v55,18.2 J9.5
  Bottom 0.254: v43,18.05 54.85,18.05 v55,18.2
SD1_CMD  (via drill 0.35)
  Top 0.254: v43.45,20.41 43.21,20.41 43.21,26.5 41.16,28.55 U4.141 | v55.2,20.4 J9.3
  Bottom 0.254: v43.45,20.41 v43.46,20.4 v55.2,20.4
SD1_DAT0  (via drill 0.35)  (1 unrouted)
  Top 0.254: 39.62,29.05 39.63,29.06 | v43.05,16.1 44.15,17.2 44.15,21.1 43.61,21.64 43.61,26.72 41.28,29.05 U4.142 | v55,16 J9.7
  Bottom 0.254: v43.05,16.1 54.9,16.1 v55,16
SD1_DAT1  (via drill 0.35)
  Top 0.254: v43.15,14.85 44.6,16.3 44.6,21.5 44.02,22.08 44.02,26.93 41.4,29.55 U4.143 | v55,14.9 J9.8
  Bottom 0.254: v43.15,14.85 54.95,14.85 v55,14.9
SD1_DAT2  (via drill 0.35)
  Top 0.254: U4.144 41.53,30.05 42.69,28.89 v43.09,28.89 | v55.4,22.6 J9.1
  Bottom 0.254: v43.09,28.89 43.09,26.59 47.08,22.6 v55.4,22.6
SD1_DAT3  (via drill 0.35)
  Top 0.254: U4.145 42.06,30.55 v42.46,30.16 | v55.3,21.5 J9.2
  Bottom 0.254: v42.46,30.16 42.46,25.4 46.35,21.5 v55.3,21.5
SD1_WP
  Top 0.254: U4.147 42.75,31.55 44.5,29.8 44.5,28.5 45,28 45,26.2 46.23,24.98 J9.9
TCK
  Top 0.254: J11.7 7.47,23.15 11.62,23.15 13.03,24.55 U4.88
TDI
  Top 0.254: U4.91 16.95,21.35 14.5,18.9 7.9,18.9 J11.1
TDO
  Top 0.254: U4.90 16.46,22.62 16.46,21.52 14.47,19.54 J11.3
TMS
  Top 0.254: U4.89 15.95,21.73 14.51,20.28 7.8,20.28 J11.5
TXM
  Bottom 0.254: U3.5 46.95,64.7 48.3,66.05 48.3,69.9 46,72.2 J4.2
TXP
  Bottom 0.254: U3.6 47.35,64.2 49,65.85 49,72.99 J4.1
USB_N
  Top 0.254: R5.P$1 13.3,80 12.3,79 12.3,46 12.75,45.55 U4.46
USB_P
  Top 0.254: R6.P$1 12.3,80.05 11.82,79.58 11.82,45.6 12.38,45.05 U4.47
USB_VBUS_B
  Top 0.254: U4.44 15.95,77.95 14.4,79.5 R4.P$1
USBHS_FAULT  (via drill 0.35)
  Top 0.254: U2.3 27.8,72.2 R12.P$1 27.23,70.23 v26.6,70.23 | U4.78 8.8,29.55 v8.55,29.8
  Bottom 0.254: v26.6,70.23 13.9,70.23 11.6,67.93 11.6,44.9 11.9,44.6 11.9,39.3 11.8,39.2 11.8,38.4 11,37.6 11,31.5 9.3,29.8 v8.55,29.8
USBHS_N
  Top 0.254: J3.D- 26,76.6 24.6,75.2 24.6,62.95 19.75,58.1 19.75,52.85 22.45,50.15 U4.31
USBHS_P
  Top 0.254: J3.D+ 24,62.95 19.3,58.25 19.3,52.65 21.95,50 U4.32
USBHS_VBUS  (via drill 0.35)  (2 unrouted)
  Top 0.254: U2.5 27.35,76.25 27.35,77.25 28,77.9 J3.VBUS 28.5,76.89 C11.P$1 31.1,77 | 29.6,76.7 29.6,74.4 C15.1 | v29.65,68.35 29.05,68.35 27.3,66.6 27.3,60.5 31,56.8 31,53.85 29.25,52.1 29.25,49.17 29.45,48.98 U4.17
  Top 0.508: U2.5 25.8,74.8
  Bottom 0.254: v29.65,68.35 29.6,68.4 v29.6,76.9
USBHS_VBUSEN
  Top 0.254: R1.P$1 25.8,72.2 U2.1
VBUS
  Top 0.4: R4.P$2 C16.P$1
  Top 0.406: J2.P$1 14.4,87.72 R7.P$2 C16.P$1
VCL_F(FLASH)  (via drill 0.35)
  Top 0.254: U4.112 27.45,19.95 v27.1,19.6
  Bottom 0.254: C36.P$2 26.99,18.78 26.99,19.59 27,19.6 v27.1,19.6
VDD  (via drill 0.35)  (3 unrouted)
  Top 0.254: U4.171 41.09,43.55 v41.25,43.39 | U4.48 15.75,44.55 v16.2,44.1 | U4.84 11.75,26.55 v11.5,26.8 | v20.1,21.3 19.95,21.45 U4.97 | U4.110 26.45,20.95 v26.75,20.65 | U4.149 40.4,32.55 v40.6,32.75 | U4.155 41.05,35.55 v41.1,35.5 | U4.154 40.65,35.05 v41.1,35.5 | v41.1,35.5 41.3,35.7 41.3,36.62 40.88,37.05 U4.158 | U4.34 20.95,49.3 v21.05,49.4 | U4.25 25.45,49.25 v25.2,49.5 | v25.2,49.5 | U4.26 24.95,49.25 v25.2,49.5 | v25.2,49.5 | U4.138 40.75,27.05 v40.95,27.25 | v12.6,38.25 12.8,38.05 U4.61 | U4.123 32.95,21.15 v33.2,20.9
  Top 0.406: v43.8,69.74 42.6,70.94 40.6,70.94 40.6,70.93 | v27.2,67.7 29.2,69.7 31.3,69.7 32.53,70.93 40.6,70.93 | v40.6,60 40.6,70.93
  Top 0.508: v43.8,69.74 43.85,69.79 50,69.79 50.6,69.19 v50.6,69 51.09,68.51 R13.P$2 | 40.6,67.54 v40.6,60 | v55.1,19.3 J9.4
  Bottom 0.152: U3.14 31.61,64.72
  Bottom 0.254: R23.P$2 36.07,88.69 36.08,88.95 | U3.14 29.95,64.7 29.4,64.15 C49.P$1 | v41.25,43.39 37.35,43.39 C30.P$2 R27.P$2 | v11.5,26.8 17.8,26.8 17.96,26.96 C32.P$1 | v40.6,32.75 40.4,32.55 35.1,32.55 34.8,32.25 C56.P$2 34.8,33.9 | v41.1,35.5 40.96,35.36 C55.P$2 35.86,35.36 C1.P$2 C2.P$2 34.84,35.33 R26.P$2 | C14.P$2 32.93,25.52 32.92,21.18 v33.2,20.9 | v40.95,27.25 40.75,27.05 36.37,27.05 C54.P$2 36.34,25.57 36.4,25.52 | v20.1,21.3 20.1,25.4 C13.P$2 | C58.P$1 25.2,44.65 v25.2,49.5 | C60.P$1 20.95,44.69 20.95,49.3 v21.05,49.4 | 17.61,44.56 C61.P$2 | C59.P$1 18.02,34.69 R18.P$2 | C10.P$2 26.75,25.57 v26.75,20.65
  Bottom 0.406: v27.2,67.7 26.89,67.39 26.89,63.11 27.35,62.65 27.4,62.6 C48.P$1
  Bottom 0.508: 43.8,69.85 43.78,69.83 FB2/2.1 | v40.6,60 40.6,59.8 39.36,58.56 R29.P$2 38.77,58.51 R28.P$2 | C34.P$1 51.8,71.6 50.9,71.6 | C35.P$1 51.8,70.6 50.9,70.6 | C33.P$1 50.95,69.65 50.9,69.7 | R24.P$2 44.8,88.77 | 44.8,88.77 36.16,88.77 36.07,88.69 | 44.8,88.77 44.8,79.58 47.08,77.3 47.8,77.3 L3.2 | 18.8,25.61 C13.P$2 C10.P$2 29.4,25.62 C14.P$2 33.14,25.52 36.4,25.52 R21.P$1 R20.P$1 38.75,25.52 40.35,23.92 40.35,21.15 42.2,19.3 v55.1,19.3 | 18.79,25.61 17.96,26.44 C32.P$1 18.02,27.21 R18.P$2 18.02,33.48 17.96,33.42 | C59.P$1 17.85,34.85 | C58.P$1 25.2,44.65 C60.P$1 20.89,44.66 C61.P$2 16.76,44.66 v16.2,44.1 14.8,44.1 12.6,41.9 v12.6,38.25 | R26.P$2 33.84,33.96 33.9,33.9 | R27.P$2 35.46,41.56 34.5,40.6 32,40.6 30.6,39.2 30.6,33.9 | C49.P$1 C48.P$1
  Bottom 0.813: L3.2 50.9,71.6 50.9,70.6 50.9,69.7 50.9,69.3 v50.6,69 | C61.P$2 14.9,47.48 14.9,58.6 18.95,62.65 27.35,62.65 | J11.4 J11.2 5.86,14.6 11.2,14.6 18.8,22.2 18.8,25.61
  Bottom 1.016: 34.8,33.9 33.9,33.9 30.6,33.9 29.4,32.7 29.4,25.62
VDD5  (via drill 0.35)
  Top 0.254: C8.P$1 31.1,70.95 | C5.P$1 29.15,70.95 R12.P$2 29,70.6 27.7,69.3 R1.P$2
  Top 0.508: U2.4 28.49,74 28.49,72.78 29,72.28 R12.P$2 | J1.P$3 53.7,77.62 51.9,79.42 v51.9,90 | C5.P$1 C8.P$1 31.35,70.95 v32.4,72
  Bottom 0.508: v51.9,90 51.88,89.98 34.3,89.98 33.7,89.38 33.7,80.6 32.4,79.3 v32.4,72
VDD_1.2
  Bottom 0.254: U3.1 37.38,66.7 C46.P$1 C45.P$1
VDD_ENET1
  Bottom 0.254: U3.2 39.6,66.2 39.91,66.5 C44.P$1 C43.P$1 41.61,66.99 43.68,66.99
  Bottom 0.508: C43.P$1 41.64,66.94 | 43.68,66.99 FB2/2.2
VDDIN
  Bottom 0.813: 53.18,74.12 L3.1
  Bottom 1.016: J1.P$2 53.49,73.81 53.18,74.12
XCIN
  Top 0.254: X3.P$1 28.45,54.74 27.96,54.25 27.96,53.73 C50.P$1 26.65,52.42 26.65,51.08 27.95,49.77 U4.20
XCOUT
  Top 0.254: U4.21 27.45,49.49 25.97,50.98 25.97,51.52 C51.P$1 25.57,53.66 X3.P$2
XII  (1 unrouted)
  Bottom 0.254: U3.8 34.35,61.7 34.83,61.22 39.31,61.22 39.32,61.2 41.9,61.2 42.5,60.6 44.07,60.6 | U5.1 45.59,60.65 44.12,60.65 C42.P$1
XOO
  Bottom 0.254: U3.7 34.85,62.28 35.33,61.8 43.86,61.8 C41.P$1 44.09,61.91 44.8,61.2 47.76,61.2 48.05,61.49 U5.3
XTAL1
  Top 0.254: X4.1 23.46,57.01 22.7,56.25 22.7,53.47 C52.P$1 23.4,52.77 23.4,51.5 24.16,50.74 25.53,50.74 26.45,49.82 U4.23
XTAL2
  Top 0.254: X4.3 21.6,55.1 21.6,53.38 21.87,53.12 C53.P$1 22.04,52.95 22.84,52.14 22.84,51.06 23.57,50.33 25.32,50.33 25.95,49.7 U4.24

### Text on the board
tNames: 10 | 9 | E | 5V | 3.3V | 1 | 2 | GND | 19 | 20 | 20 | 19 | 2 | 1 | 1 | 9 | 2 | 1 | 10 | 2 | 10 | 9 | GND | RESET | TCK | TMS | VDD | TDO | TDI | 2 | 1 | Titan | 39 | 1 | 40 | 2
bNames: Titan